# Altium project HU_SUPPORT_BOARD.PrjPcb (part 1 of 2)
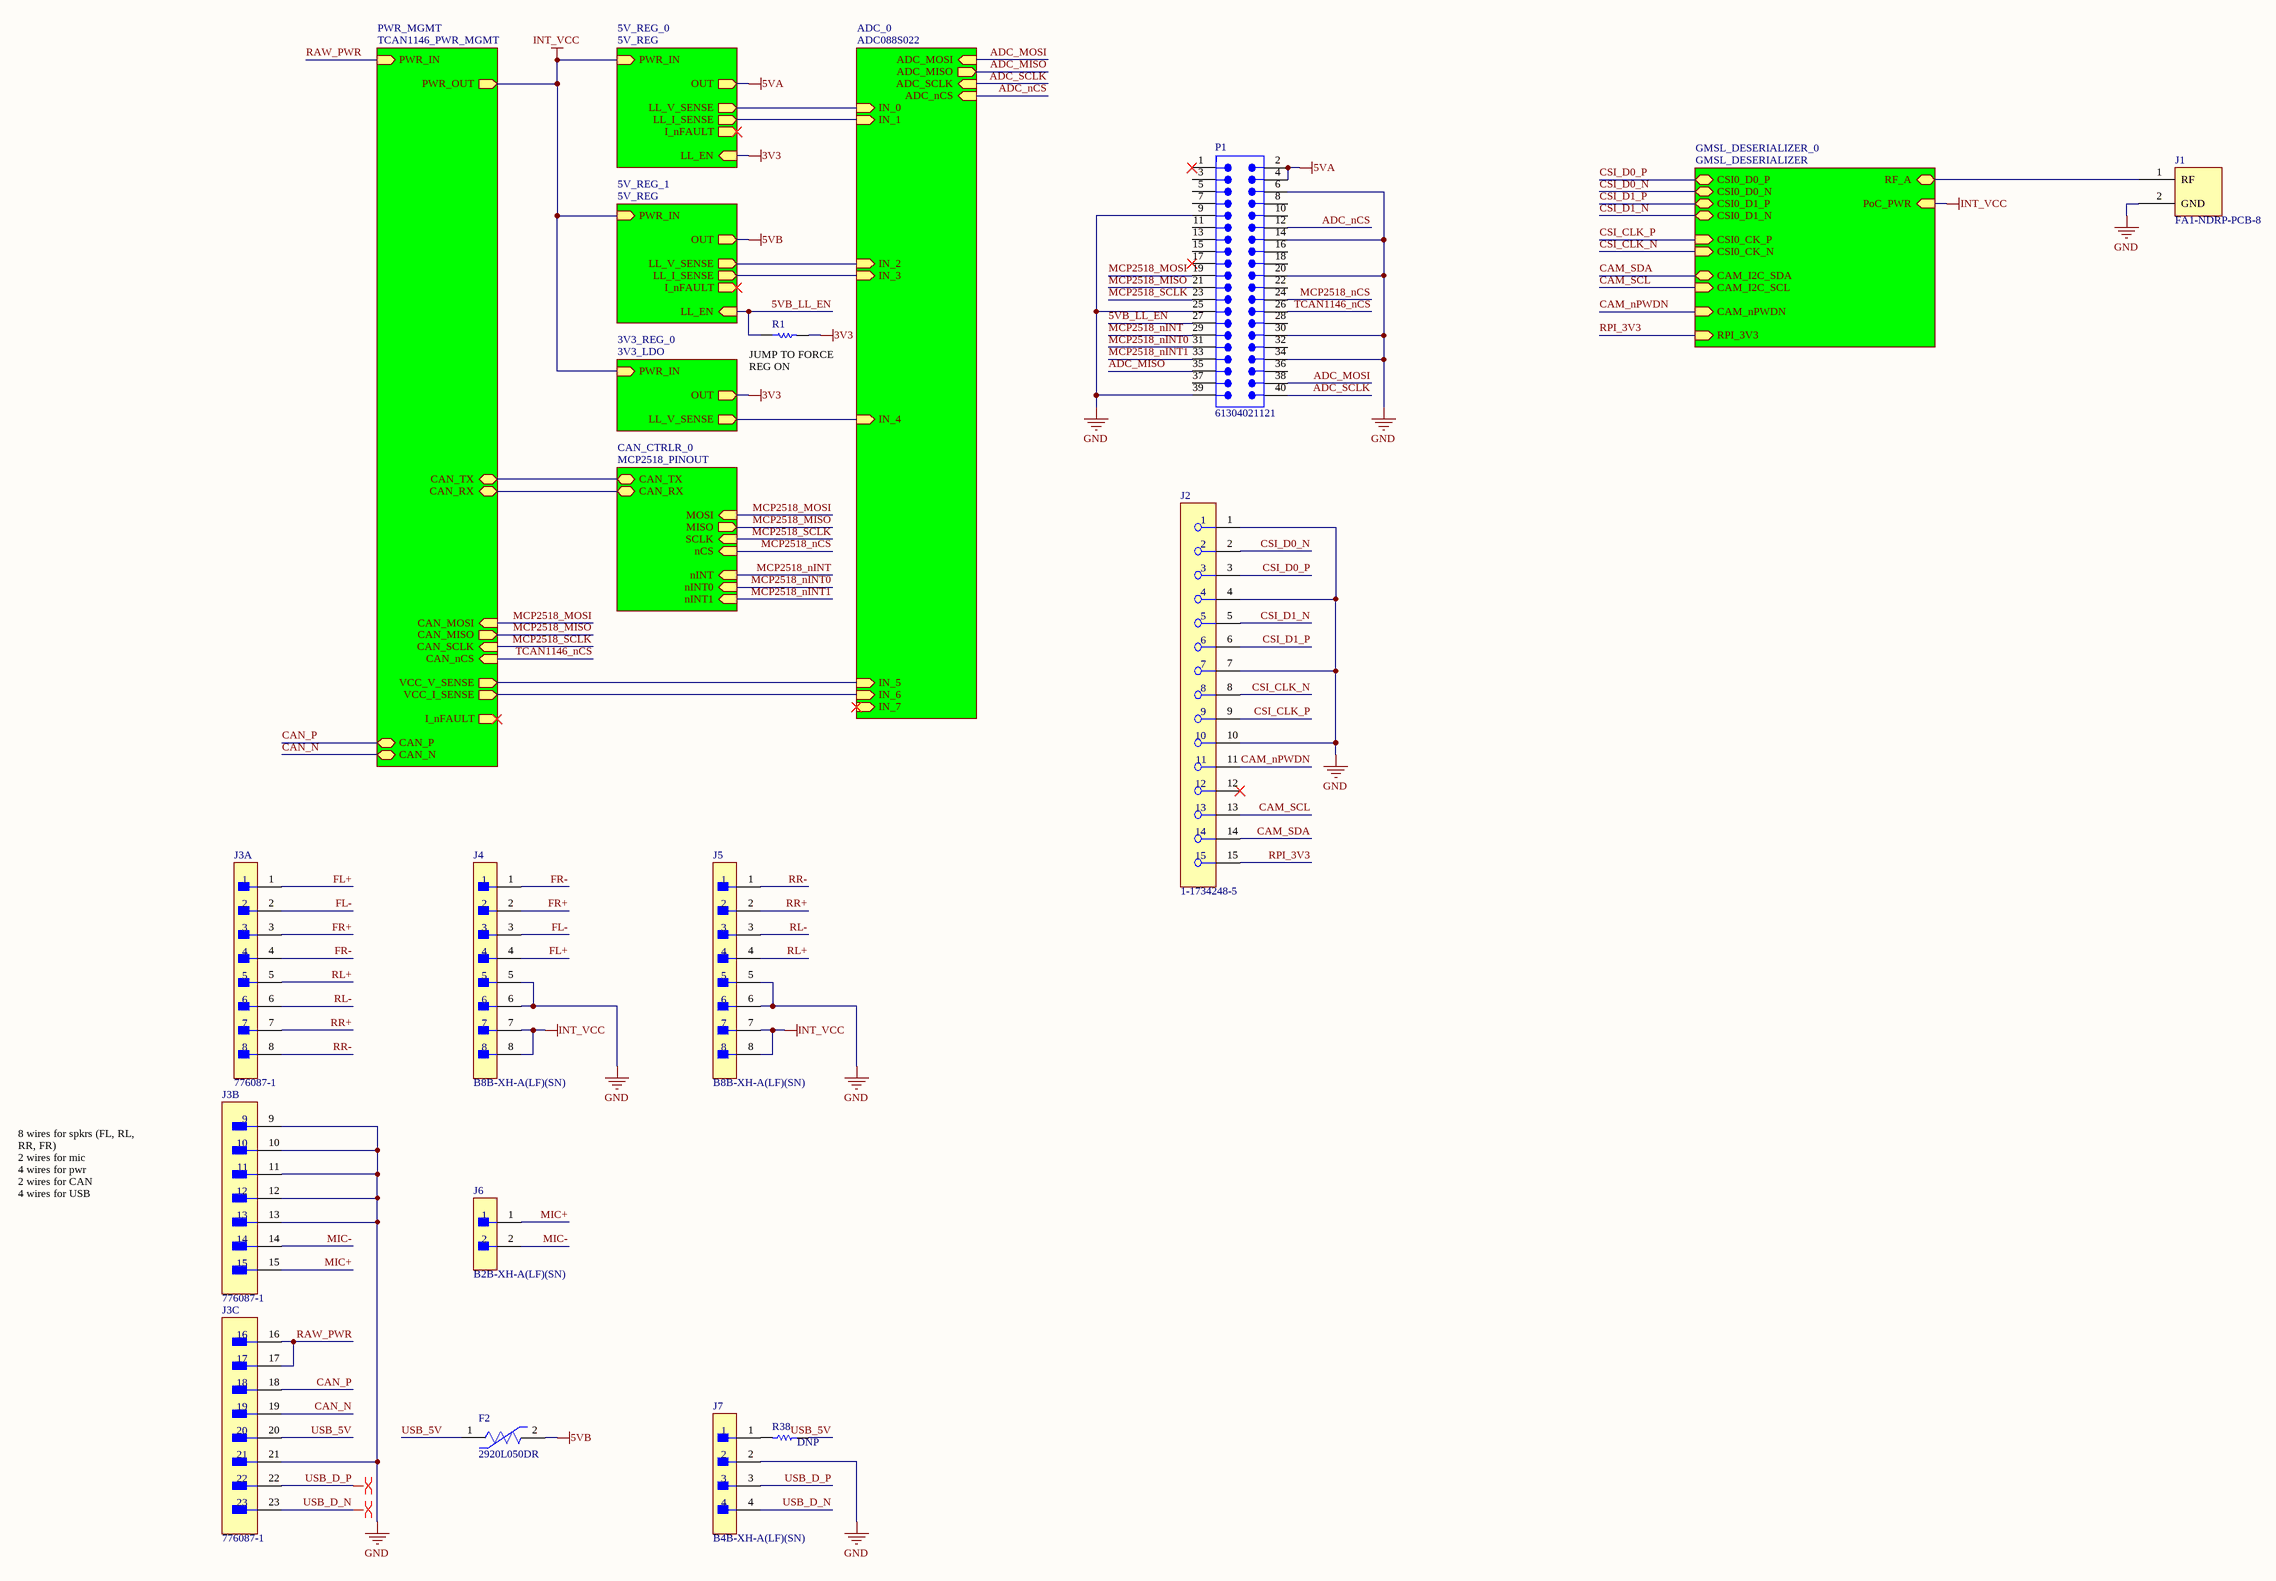
[diagram p0: HU_SUPPORT_BOARD.SchDoc]
7 sheets, 158 parts. Net scope: hierarchical (ports join the sheet entries above them; power ports are global).
Board file: HU_SUPPORT_BOARD.PcbDoc
Sheets:
  HU_SUPPORT_BOARD.SchDoc
    PWR_MGMT = TCAN1146_PWR_MGMT.SchDoc
    5V_REG_0 = 5V_REG.SchDoc
    5V_REG_1 = 5V_REG.SchDoc
    GMSL_DESERIALIZER_0 = GMSL_DESERIALIZER.SchDoc
    CAN_CTRLR_0 = MCP2518_PINOUT.SchDoc
    ADC_0 = ADC088S022.SchDoc
    3V3_REG_0 = 3V3_LDO.SchDoc

## Sheet HU_SUPPORT_BOARD.SchDoc
size C; SheetNumber: 1; SheetTotal: 7

### Parts
F2  2920L050DR  [FP-2920L050DR-MFG]
J1  FA1-NDRP-PCB-8  [FA1-NDRP-PCB-8-Footprint-1]
J2  1-1734248-5  [FP-1-1734248-5-MFG]
J3  776087-1  [FP-776087-1-MFG]  (parts A,B,C of 3)
J4  B8B-XH-A(LF)(SN)  [FP-B8B-XH-A_LF_SN-MFG]
J5  B8B-XH-A(LF)(SN)  [FP-B8B-XH-A_LF_SN-MFG]
J6  B2B-XH-A(LF)(SN)  [FP-B2B-XH-A_LF_SN-MFG]
J7  B4B-XH-A(LF)(SN)  [FP-B4B-XH-A_LF_SN-MFG]
P1  61304021121  [61304021121]
R1  DNP  [RESC1005X40X25ML05T05]  (value not drawn)
R38  DNP  [R0603B]

### Sub-sheets
3V3_REG_0 = 3V3_LDO: PWR_IN (in), OUT (out), LL_V_SENSE (out)
5V_REG_0 = 5V_REG: PWR_IN (in), LL_EN (in), OUT (out), LL_V_SENSE (out), LL_I_SENSE (out), I_nFAULT (out)
5V_REG_1 = 5V_REG: PWR_IN (in), LL_EN (in), OUT (out), LL_V_SENSE (out), LL_I_SENSE (out), I_nFAULT (out)
ADC_0 = ADC088S022: IN_0 (in), IN_1 (in), IN_2 (in), IN_3 (in), IN_4 (in), IN_5 (in), IN_6 (in), IN_7 (in), ADC_MOSI (in), ADC_MISO (out), ADC_SCLK (in), ADC_nCS (in)
CAN_CTRLR_0 = MCP2518_PINOUT: CAN_TX (bidir), CAN_RX (bidir), MOSI (in), MISO (out), SCLK (in), nCS (in), nINT (in), nINT0 (in), nINT1 (in)
GMSL_DESERIALIZER_0 = GMSL_DESERIALIZER: CSI0_D0_P (bidir), CSI0_D0_N (bidir), CSI0_D1_P (bidir), CSI0_D1_N (bidir), CSI0_CK_P (in), CSI0_CK_N (in), CAM_I2C_SDA (bidir), CAM_I2C_SCL (in), PoC_PWR (in), CAM_nPWDN (in), RF_A (bidir), RPI_3V3 (in)
PWR_MGMT = TCAN1146_PWR_MGMT: PWR_IN (in), PWR_OUT (out), CAN_TX (bidir), CAN_RX (bidir), CAN_SCLK (in), CAN_MISO (out), CAN_MOSI (in), CAN_nCS (in), VCC_V_SENSE (out), VCC_I_SENSE (out), I_nFAULT (out), CAN_P (bidir), CAN_N (bidir)

### Nets
3V3: R1.2 ; sheet 5V_REG_0/LL_EN, sheet 3V3_REG_0/OUT
5VA: P1.2 P1.4 ; sheet 5V_REG_0/OUT
5VB: F2.2 ; sheet 5V_REG_1/OUT
GND: J1.2(GND) J2.1 J2.4 J2.7 J2.10 J3.9 J3.10 J3.11 J3.12 J3.13 J3.21 J4.5 J4.6 J5.5 J5.6 J7.2 P1.6 P1.9 P1.14 P1.20 P1.25 P1.30 P1.34 P1.39
INT_VCC: J4.7 J4.8 J5.7 J5.8 ; sheet PWR_MGMT/PWR_OUT, sheet 5V_REG_0/PWR_IN, sheet 5V_REG_1/PWR_IN, sheet GMSL_DESERIALIZER_0/PoC_PWR, sheet 3V3_REG_0/PWR_IN  [project net PoC_PWR]
5VB_LL_EN: P1.27 R1.1 ; sheet 5V_REG_1/LL_EN
ADC_MISO: P1.35 ; sheet ADC_0/ADC_MISO
ADC_MOSI: P1.38 ; sheet ADC_0/ADC_MOSI
ADC_nCS: P1.12 ; sheet ADC_0/ADC_nCS
ADC_SCLK: P1.40 ; sheet ADC_0/ADC_SCLK
CAM_nPWDN: J2.11 ; sheet GMSL_DESERIALIZER_0/CAM_nPWDN
CAM_SCL: J2.13 ; sheet GMSL_DESERIALIZER_0/CAM_I2C_SCL  [project net CAM_I2C_SCL]
CAM_SDA: J2.14 ; sheet GMSL_DESERIALIZER_0/CAM_I2C_SDA  [project net CAM_I2C_SDA]
CAN_N: J3.19 ; sheet PWR_MGMT/CAN_N
CAN_P: J3.18 ; sheet PWR_MGMT/CAN_P
CAN_RX: sheet PWR_MGMT/CAN_RX, sheet CAN_CTRLR_0/CAN_RX
CAN_TX: sheet PWR_MGMT/CAN_TX, sheet CAN_CTRLR_0/CAN_TX
CSI_CLK_N: J2.8 ; sheet GMSL_DESERIALIZER_0/CSI0_CK_N
CSI_CLK_P: J2.9 ; sheet GMSL_DESERIALIZER_0/CSI0_CK_P
CSI_D0_N: J2.2 ; sheet GMSL_DESERIALIZER_0/CSI0_D0_N
CSI_D0_P: J2.3 ; sheet GMSL_DESERIALIZER_0/CSI0_D0_P
CSI_D1_N: J2.5 ; sheet GMSL_DESERIALIZER_0/CSI0_D1_N
CSI_D1_P: J2.6 ; sheet GMSL_DESERIALIZER_0/CSI0_D1_P
FL+: J3.1 J4.4
FL-: J3.2 J4.3
FR+: J3.3 J4.2
FR-: J3.4 J4.1
MCP2518_MISO: P1.21 ; sheet PWR_MGMT/CAN_MISO, sheet CAN_CTRLR_0/MISO  [project net CAN_MISO]
MCP2518_MOSI: P1.19 ; sheet PWR_MGMT/CAN_MOSI, sheet CAN_CTRLR_0/MOSI  [project net CAN_MOSI]
MCP2518_nCS: P1.24 ; sheet CAN_CTRLR_0/nCS
MCP2518_nINT: P1.29 ; sheet CAN_CTRLR_0/nINT
MCP2518_nINT0: P1.31 ; sheet CAN_CTRLR_0/nINT0
MCP2518_nINT1: P1.33 ; sheet CAN_CTRLR_0/nINT1
MCP2518_SCLK: P1.23 ; sheet PWR_MGMT/CAN_SCLK, sheet CAN_CTRLR_0/SCLK  [project net CAN_SCLK]
MIC+: J3.15 J6.1
MIC-: J3.14 J6.2
PoC_A: J1.1(RF) ; sheet GMSL_DESERIALIZER_0/RF_A
RAW_PWR: J3.16 J3.17 ; sheet PWR_MGMT/PWR_IN
RL+: J3.5 J5.4
RL-: J3.6 J5.3
RPI_3V3: J2.15 ; sheet GMSL_DESERIALIZER_0/RPI_3V3
RR+: J3.7 J5.2
RR-: J3.8 J5.1
TCAN1146_nCS: P1.26 ; sheet PWR_MGMT/CAN_nCS  [project net CAN_nCS]
USB_5V: F2.1 J3.20 R38.1
USB_D_N: J3.23 J7.4
USB_D_P: J3.22 J7.3
NetJ7_1: J7.1 R38.2
NetR4_5V_REG_0_1: sheet 5V_REG_0/LL_V_SENSE, sheet ADC_0/IN_0
NetR4_5V_REG_1_1: sheet 5V_REG_1/LL_V_SENSE, sheet ADC_0/IN_2
NetR27_1: sheet PWR_MGMT/VCC_V_SENSE, sheet ADC_0/IN_5
NetR36_1: sheet ADC_0/IN_4, sheet 3V3_REG_0/LL_V_SENSE
NetU2_5V_REG_0_7: sheet 5V_REG_0/LL_I_SENSE, sheet ADC_0/IN_1
NetU2_5V_REG_1_7: sheet 5V_REG_1/LL_I_SENSE, sheet ADC_0/IN_3
NetU7_7: sheet PWR_MGMT/VCC_I_SENSE, sheet ADC_0/IN_6

Not connected (* = marked no-connect by the designer): J2 12*; P1 1* 3 5 7 8 10 11 13 15 16 17* 18 22 28 32 36 37

### Layout directives
differential pair: USB_D_N, USB_D_P

### Notes on the sheet
- (near R1) JUMP TO FORCE REG ON
- 8 wires for spkrs (FL, RL, RR, FR)
  2 wires for mic
  4 wires for pwr
  2 wires for CAN
  4 wires for USB

### Library data of the parts
F2 = CMP-08606-000071-1: PTC RESET FUSE 60V 500MA 2920; Resistance: 1.4R; Trip Current: 1A; Power Dissipation: 1.5W; Time to Trip: 4s; Approvals: cULus; Current Rating: 10A; Operating Supply Voltage: 60V; Termination: SMD/SMT; Width: 5.44mm; Case/Package: 2920; Series: 2920L; Case Code (Imperial): 2920; Height: 1.25mm; Hold Current: 500mA; Terminal Material: Copper; Min Operating Temperature: -40°C; Package Quantity: 1500; Max Voltage Rating (DC): 60V; RoHS Compliant: Yes; Case Code (Metric): 7351; Lead Free: Lead Free; Max Operating Temperature: 85°C; Voltage Rating (DC): 60V; Working Voltage: 60V; Length: 7.98mm; REACH SVHC: No SVHC; Max Current Rating: 10A; Voltage Rating: 60V; Packaging: Tape and Reel
J1 = CMP-002-00054-1: RF F Connector, Male, Board Mount, Solder Terminal, Plug; Connector Type: RF F CONNECTOR; RoHS Compliant: Yes; Mounting Technology: Board
J2 = CMP-03368-000001-1: CONN FPC VERT 15POS 1.00MM SMD; Manufacturer: TE; Conn Orientation: Vertical; Conn Gender: Female; Current Rating: 1A; Is Female: yes; Number Of Contacts: 15; Pitch: 1mm; Voltage Rating: 125V; ComponentLink2URL: https://www.te.com/commerce/DocumentDelivery/DDEController?Action=showdoc&DocId=Customer+Drawing%7F1734248%7FE1%7Fpdf%7FEnglish%7FENG_CD_1734248_E1__.pdf%7F1-1734248-5; Device Class L1: Connectors; Category: Conn; Package: 0; Lead Free: Yes; Digikey Description: CONN FPC VERT 15POS 1.00MM SMD; Height: 8mm; Manufacturer Part Number: 1-1734248-5; Temperature: -20°C to +85°C; Contact Material: Gold,Nickel; Device Class L3: unset; ComponentLink2Description: Datasheet; RoHS: TRUE; Temperature Range Low: -20°C; Octopart: https://octopart.com/1-1734248-5-te+connectivity-40620898; Device Class L2: FFC / FPC; Mouser Description: FFC & FPC Connectors 15P 1.0 FPC, Zip V/T SMT; Automotive: No; Temperature Range High: +85°C; Mounting Type: Surface Mount
J3 = CMP-03369-000157-2: CONN HEADER R/A 23POS 4MM; Max Voltage Rating (AC): 250V; PCB Thickness: 0.062inch; PCB Mount Alignment: Yes (With); Primary Type: Rectangular; Number of Signal Positions: 23; Row Spacing: 0.157inch; Current Rating: 17A; Connector System: Wire-to-Device; Number of Ports: 1; Shielding: Unshielded; PCB Mount Retention: With; Circuit Application: Power; Tab Thickness: 1.3mm; Gender: Male; Contact Shape: Circular; Mount: Through Hole; ELV: Compliant; Orientation: Right Angle; Lead Free: Lead Free; Contact Plating: Tin; Package Quantity: 1; RoHS Compliant: Yes; Connector Type: Header; Series: Ampseal; Termination: Solder; Voltage Rating (AC): 250V; Contact Material: Brass; Number of Rows: 3; Depth: 37.9mm; Housing Material: Polybutylene; Fastening Type: Ramp; Width: 37.9mm; Flammability Rating: UL94 V-0; Housing Color: Black; Radiation Hardening: No; Contact Type: Male Pin; Sealable: Yes (With); Length: 60.8mm; Max Operating Temperature: 221°C; Packaging: Bulk; Number of Positions: 23; Insulation Material: PBT; Pitch: 0.157inch; Contact Finish - Mating: TIN; Color: Black; Number of Terminals/Pins: 23; Insulation Color: Black; Number of Contacts: 23; Min Operating Temperature: -40°C
J4 J5 = CMP-17438-000015-1: CONN HEADER VERT 8POS 2.5MM; Voltage Rating (AC): 250V; Insulation Resistance: 1GR; Connector Type: Male Pin; Max Current Rating: 3A; Wire/Cable Gauge: 22AWG; Number of Contacts: 8; Contact Resistance: 20mR; Orientation: Straight; Pitch: 2.5mm; Min Operating Temperature: -25°C; Number of Rows: 1; Contact Type: Male Pin; Packaging: Bulk; Lead Free: Lead Free; Max Operating Temperature: 85°C; Housing Material: Polyamide; Voltage Rating: 250V; Series: XH; Mount: Through Hole; Depth: 5.75mm; Contact Material: Brass; Fastening Type: Detent; Color: Natural; Max Voltage Rating (AC): 250V; Number of Positions: 8; Housing Color: White; Contact Plating: Tin; Lead Pitch: 2.5mm; Length: 22.4mm; REACH SVHC: No SVHC; Termination: Press-Fit; Current Rating: 3A
J6 = CMP-2000-05888-3: CONN HEADER VERT 2POS 2.5MM; Current Rating: 3A; Voltage Rating: 250V; Number of Contacts: 2; Contact Resistance: 20mR; Wire/Cable Gauge: 22AWG; Insulation Resistance: 1GR; Connector Type: Male Pin; Packaging: Bulk; Contact Material: Brass; Lead Free: Lead Free; Orientation: Straight; Contact Plating: Tin; Max Current Rating: 3A; Termination: Solder; Fastening Type: Detent; Depth: 5.75mm; Housing Material: Polyamide; REACH SVHC: No SVHC; Series: XH; Voltage Rating (AC): 250V; Number of Positions: 2; Color: Natural; Contact Type: Male Pin; Max Voltage Rating (DC): 250V; Pitch: 2.5mm; Lead Pitch: 2.5mm; Mount: Through Hole; Max Operating Temperature: 85°C; Length: 7.4mm; Max Voltage Rating (AC): 250V; Min Operating Temperature: -25°C; Number of Rows: 1; Housing Color: White
J7 = CMP-17439-000250-1: CONN HEADER VERT 4POS 2.5MM; Number of Contacts: 4; Contact Resistance: 20mR; Voltage Rating: 250V; Max Current Rating: 3A; Gender: Male; Wire/Cable Gauge: 22AWG; Mated Stacking Heights: 9.8mm; Insulation Resistance: 1GR; Orientation: Straight; Contact Type: Male Pin; Contact Finish - Mating: TIN; Series: XH; Max Voltage Rating (AC): 250V; Lead Pitch: 2.5mm; Contact Shape: Square; Insulation Color: Natural; Termination: Solder; Lead Free: Lead Free; Voltage Rating (AC): 250V; Number of Rows: 1; Flammability Rating: UL94 V-0; Number of Positions: 4; Max Operating Temperature: 85°C; Package Quantity: 500; Mount: Through Hole; REACH SVHC: No SVHC; Connector Type: Header; Insulation Material: Nylon; Fastening Type: Detent; Min Operating Temperature: -25°C; Housing Color: White; Packaging: Bulk; Contact Plating: Tin; Contact Material: Brass; Max Voltage Rating (DC): 250V; Housing Material: Polyamide; Color: Natural; Material: Polyamide; Pitch: 2.5mm; Depth: 5.75mm; Current Rating: 3A; Length: 12.4mm
P1 = CMP-1502-01135-3: NexarPartId: 32855579; Pitch: 2.54mm; Operating Supply Voltage: 250V; Gender: Male; Number of Positions: 40; Current Rating: 3A; Contact Resistance: 20mΩ; Connector Type: Male Pin; Color: Black; Contact Plating: Gold; Contact Material: Copper; Number of Rows: 2; Row Spacing: 2.54mm; Mount: Through Hole; RoHS: Compliant; Contact Mating Length: 5.9944mm; Voltage Rating: 250V; Orientation: Vertical; Max Operating Temperature: 105°C; REACH SVHC: Unknown; Min Operating Temperature: -40°C; Lead Pitch: 2.54mm; Height: 8.89mm; Termination: Solder; Number of Pins: 40; Number of Contacts: 40; Packaging: Bulk
R1 = CMP-009-00118-2: READ THE NAME; Pins: 2; Component Type: Standard; Design Item ID: CMP-009-00206-2; Source: 0402jump.SchLib
R38 = CMP-009-00002-14: Resistor; Value: DNP

## Sheet TCAN1146_PWR_MGMT.SchDoc
size C; SheetNumber: 5; SheetTotal: 7
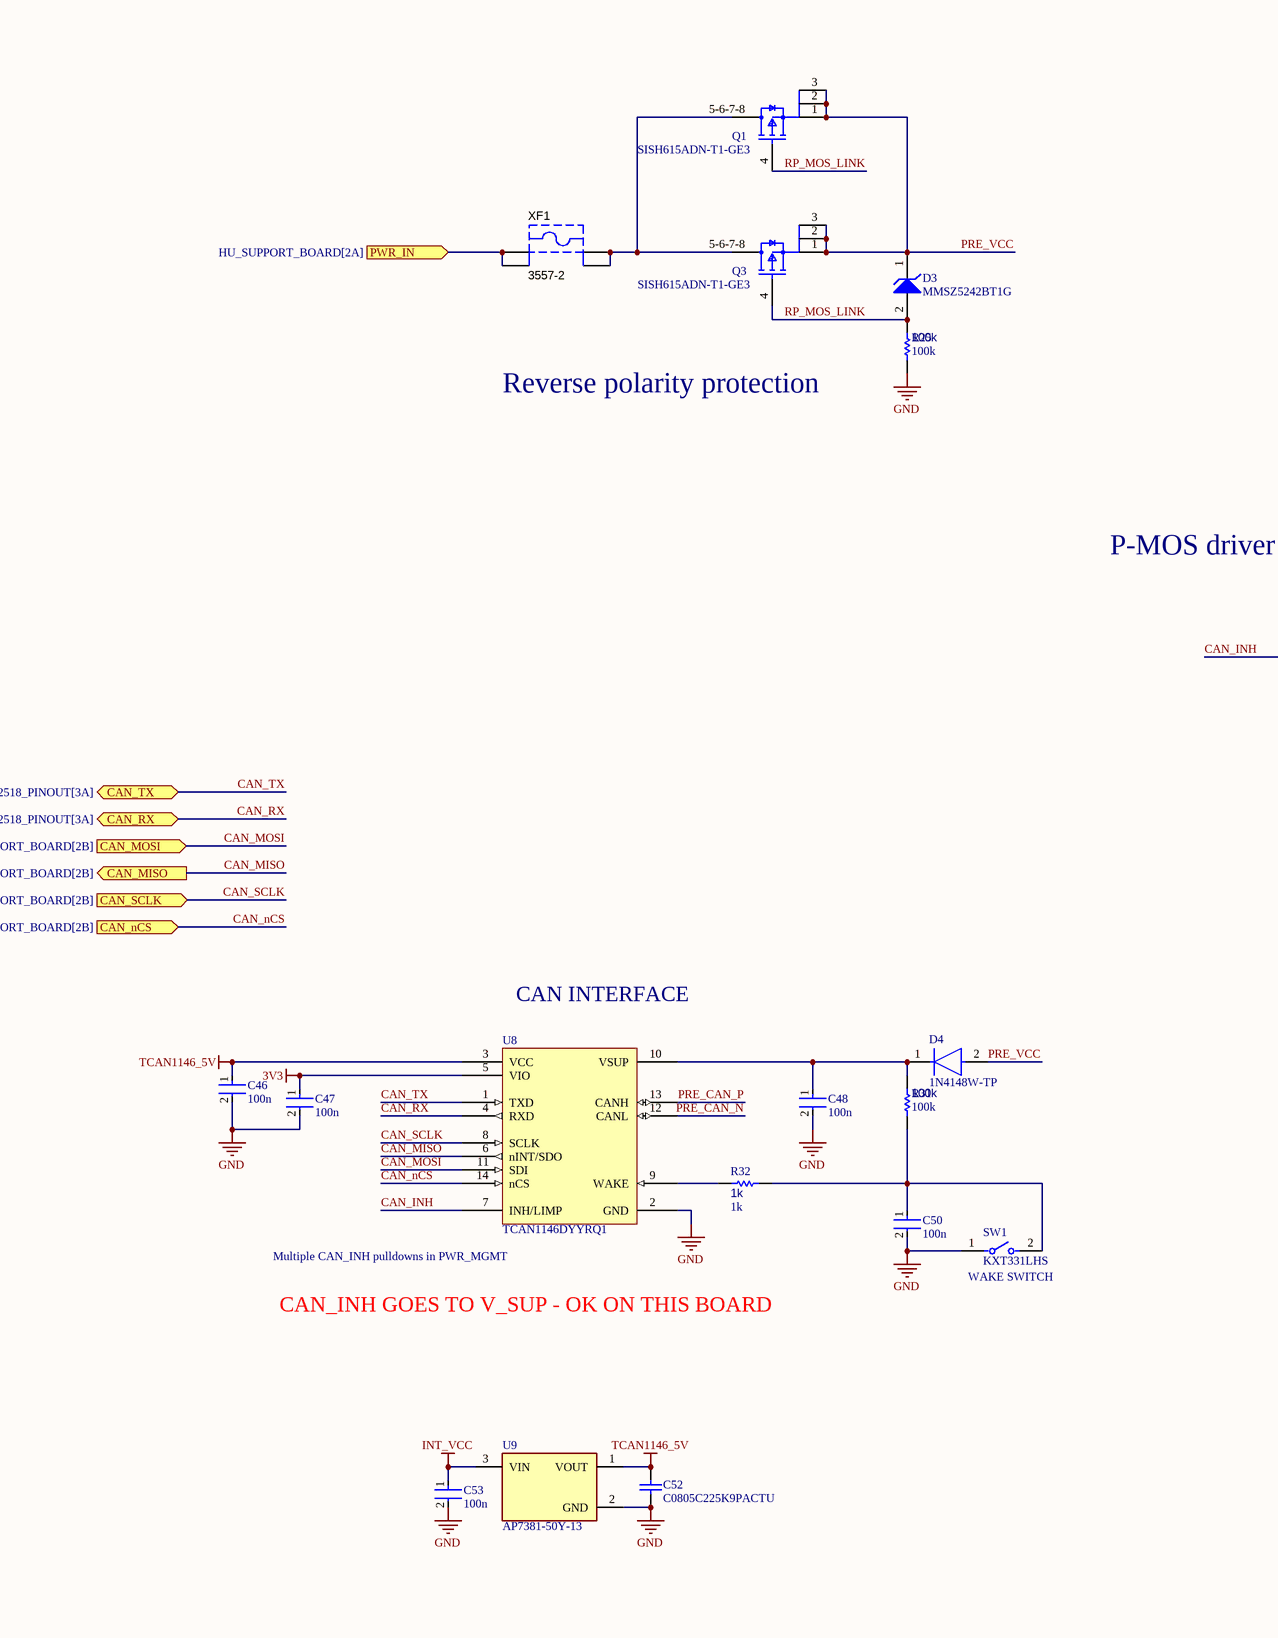
[diagram p1: TCAN1146_PWR_MGMT.SchDoc, left]
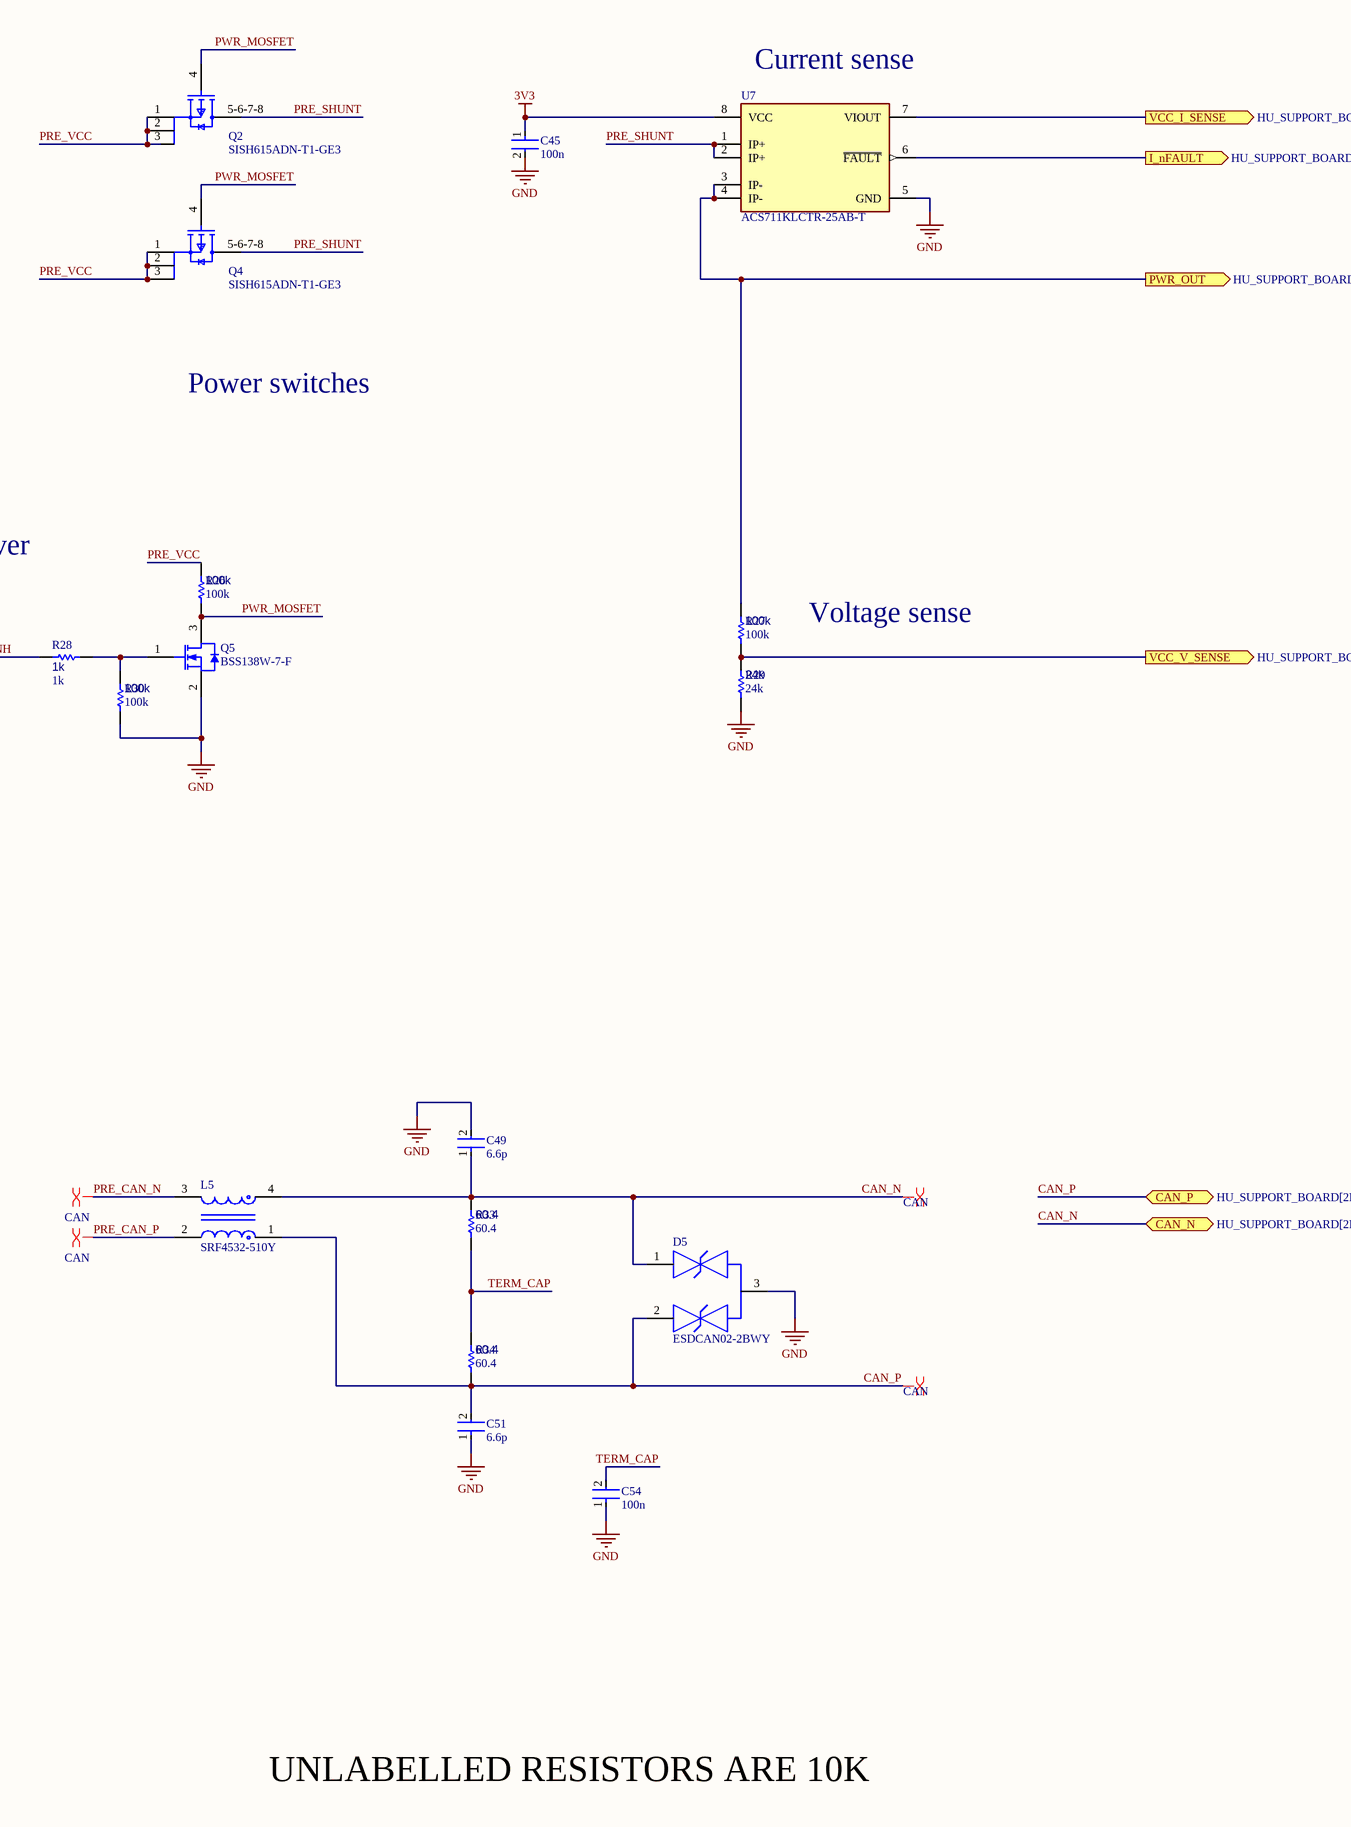
[diagram p2: TCAN1146_PWR_MGMT.SchDoc, right]

### Parts
C45  100n  [FP-0402-L_1_0_0_05-W_0_5-IPC_A]
C46  100n  [FP-0402-L_1_0_0_05-W_0_5-IPC_A]
C47  100n  [FP-0402-L_1_0_0_05-W_0_5-IPC_A]
C48  100n  [FP-0402-L_1_0_0_05-W_0_5-IPC_A]
C49  6.6p  [FP-0402-L_1_0_0_05-W_0_5-IPC_A]
C50  100n  [FP-0402-L_1_0_0_05-W_0_5-IPC_A]
C51  6.6p  [FP-0402-L_1_0_0_05-W_0_5-IPC_A]
C52  C0805C225K9PACTU  [CAPC2013X145X50ML20T25]
C53  100n  [FP-0402-L_1_0_0_05-W_0_5-IPC_A]
C54  100n  [FP-0402-L_1_0_0_05-W_0_5-IPC_A]
D3  MMSZ5242BT1G  [ONSC-SOD-123-2-425-04_V]
D4  1N4148W-TP  [FP-SOD-123-IPC_A]
D5  ESDCAN02-2BWY  [FP-SOT323-3L-MFG]
L5  SRF4532-510Y  [FP-SRF4532-MFG]
Q1  SISH615ADN-T1-GE3  [SISH615ADN-T1-GE3-Footprint-1]
Q2  SISH615ADN-T1-GE3  [SISH615ADN-T1-GE3-Footprint-1]
Q3  SISH615ADN-T1-GE3  [SISH615ADN-T1-GE3-Footprint-1]
Q4  SISH615ADN-T1-GE3  [SISH615ADN-T1-GE3-Footprint-1]
Q5  BSS138W-7-F  [DIOD-SOT323-3_V]
R25  100k  [R0603B]
R26  100k  [R0603B]
R27  100k  [R0603B]
R28  1k  [R0603B]
R29  24k  [R0603B]
R30  100k  [R0603B]
R31  100k  [R0603B]
R32  1k  [R0603B]
R33  60.4  [R0603B]
R34  60.4  [R0603B]
SW1  KXT331LHS  [FP-KXT331LHS-MFG]
U7  ACS711KLCTR-25AB-T  [FP-LC-8-IPC_A]
U8  TCAN1146DYYRQ1  [TCAN1146DYYRQ1-Footprint-1]
U9  AP7381-50Y-13  [FP-SOT89-MFG]
XF1  3557-2  [KSTN-3557-2]

### Ports
CAN_MISO (out, see HU_SUPPORT_BOARD[2B]), CAN_MOSI (in, see HU_SUPPORT_BOARD[2B]), CAN_N (bidir, see HU_SUPPORT_BOARD[2B]), CAN_nCS (in, see HU_SUPPORT_BOARD[2B]), CAN_P (bidir, see HU_SUPPORT_BOARD[2B]), CAN_RX (bidir, see HU_SUPPORT_BOARD[2B], MCP2518_PINOUT[3A]), CAN_SCLK (in, see HU_SUPPORT_BOARD[2B]), CAN_TX (bidir, see HU_SUPPORT_BOARD[2B], MCP2518_PINOUT[3A]), I_nFAULT (out, see HU_SUPPORT_BOARD[2B]), PWR_IN (in, see HU_SUPPORT_BOARD[2A]), PWR_OUT (out, see HU_SUPPORT_BOARD[2A]), VCC_I_SENSE (out, see HU_SUPPORT_BOARD[2B]), VCC_V_SENSE (out, see HU_SUPPORT_BOARD[2B])

### Nets
3V3: C45.1 C47.1 U7.8(VCC) U8.5(VIO)
GND: C45.2 C46.2 C47.2 C48.2 C49.2 C50.2 C51.1 C52.1 C53.2 C54.1 D5.3 Q5.2(S) R25.1 R29.1 R30.1 SW1.1 U7.5(GND) U8.2(GND) U9.2(GND)
INT_VCC: C53.1 R27.2 U7.3(IP-) U7.4(IP-) U9.3(VIN) ; port PWR_OUT  [project net PoC_PWR]
TCAN1146_5V: C46.1 C52.2 U8.3(VCC) U9.1(VOUT)
CAN_INH: R28.1 U8.7(INH/LIMP)
CAN_MISO: U8.6(nINT/SDO) ; port CAN_MISO
CAN_MOSI: U8.11(SDI) ; port CAN_MOSI
CAN_N: C49.1 D5.1 L5.4 R33.2 ; port CAN_N
CAN_nCS: U8.14(nCS) ; port CAN_nCS
CAN_P: C51.2 D5.2 L5.1 R34.1 ; port CAN_P
CAN_RX: U8.4(RXD) ; port CAN_RX
CAN_SCLK: U8.8(SCLK) ; port CAN_SCLK
CAN_TX: U8.1(TXD) ; port CAN_TX
PRE_CAN_N: L5.3 U8.12(CANL)
PRE_CAN_P: L5.2 U8.13(CANH)
PRE_SHUNT: Q2.5-6-7-8(D) Q4.5-6-7-8(D) U7.1(IP+) U7.2(IP+)
PRE_VCC: D3.1(K) D4.2(A) Q1.1(S) Q1.2(S) Q1.3(S) Q2.1(S) Q2.2(S) Q2.3(S) Q3.1(S) Q3.2(S) Q3.3(S) Q4.1(S) Q4.2(S) Q4.3(S) R26.2
PWR_MOSFET: Q2.4(G) Q4.4(G) Q5.3(D) R26.1
RAW_PWR: XF1.1 XF1.2 ; port PWR_IN
RP_MOS_LINK: D3.2(A) Q1.4(G) Q3.4(G) R25.2
TERM_CAP: C54.2 R33.1 R34.2
NetC48_1: C48.1 D4.1(C) R31.2 U8.10(VSUP)
NetC50_1: C50.1 R31.1 R32.2 SW1.2
NetQ1_5-6-7-8: Q1.5-6-7-8(D) Q3.5-6-7-8(D) XF1.3 XF1.4
NetQ5_1: Q5.1(G) R28.2 R30.2
NetR27_1: R27.1 R29.2 ; port VCC_V_SENSE
NetR32_1: R32.1 U8.9(WAKE)
NetU7_6: U7.6(~{FAULT}) ; port I_nFAULT
NetU7_7: U7.7(VIOUT) ; port VCC_I_SENSE

### Layout directives
differential pair; differential pair class CAN: CAN_N, CAN_P, PRE_CAN_N, PRE_CAN_P

### Notes on the sheet
- (near U7) Current sense
- (near R25) Reverse polarity protection
- Power switches
- P-MOS driver
- Voltage sense
- CAN INTERFACE
- (near U8) Multiple CAN_INH pulldowns in PWR_MGMT
- (near SW1) WAKE SWITCH
- CAN_INH GOES TO V_SUP - OK ON THIS BOARD
- UNLABELLED RESISTORS ARE 10K

### Library data of the parts
C45-C51 C53 C54 = CMP-001-00058-1: LARGE PADS, 0402 CAP, CHANGE COMMENT TO MATCH REAL P/N; Capacitor Type: Ceramic; Min Operating Temperature: -55°C; Mounting Technology: Surface Mount; Pins: 2; Case/Package: 0402; RoHS Compliant: Yes; Max Operating Temperature: 85°C
C52 = CMP-1036-04819-2: Manufacturer: Kemet; Part Number: C0805C225K9PACTU
D3 = CMP-1060-00565-1: Zener Voltage Regulator, 500 mW, 2-Pin SOD-123, Pb-Free, Tape and Reel; Manufacturer: On Semiconductor; P Max (W): 0.5; VZ Typ (V): 12; PartNumber: MMSZ5242BT1G; PackageReference: SOD-123-2-425-04; ComponentLink3URL: http://www.onsemi.com/pub_link/Collateral/425-04.PDF; Mounting Technology: Surface Mount; ComponentLink2Description: Datasheet; ComponentLink1URL: http://www.onsemi.com/; ComponentLink3Description: Package Specification; PackageDescription: 2-Pin SOD, Body 1.6 x 2.69 mm; PackageVersion: Rev. G, 10/2009; ComponentLink1Description: Manufacturer URL; RoHS: Pb-Free; ComponentLink2URL: http://www.onsemi.com/pub_link/Collateral/MMSZ5221BT1-D.PDF; Packing: Tape and Reel; DatasheetVersion: Rev. 12
D4 = CMP-2000-04993-2: DIODE GEN PURP 100V 150MA SOD123; Max Reverse Leakage Current: 5uA; Max Surge Current: 2A; Reverse Recovery Time: 4ns; Polarity: Standard; Capacitance: 4pF; Max Forward Surge Current (Ifsm): 1A; Element Configuration: Single; Power Dissipation: 400mW; Forward Voltage: 1V; Radiation Hardening: No; Lead Free: Lead Free; Max Reverse Voltage (DC): 100V; Current Rating: 150mA; Forward Current: 150mA; Packaging: Tape and Reel; Number of Pins: 2; Package Quantity: 3000; Max Operating Temperature: 150°C; Min Operating Temperature: -65°C; Average Rectified Current: 150mA; Recovery Time: 4ns; Output Current: 150mA; Peak Non-Repetitive Surge Current: 2A; Width: 1.8mm; Voltage Rating (DC): 100V; Height: 1.2mm; Max Repetitive Reverse Voltage (Vrrm): 100V; Mount: Surface Mount; Length: 2.85mm
D5 = CMP-12225-000055-1: TVS DIODE 26.5V 44V SOT323-3; Manufacturer: STMicroelectronics; Value: 3pF; Direction: Bidirectional; Breakdown Voltage: 28.5V; Automotive Grade: Grade 0; Standoff Height: 0mm; Peak Pulse Power: 170W; Peak Pulse Current: 3A; Number Of Channels: 2; Max Junction Temp: +175°C; Mouser Description: TVS Diodes / ESD Suppressors Automotive dual-line Transil, Transient voltage suppressor (TVS) for CAN bus; Height: 1.1mm; Category: Diode; Reverse Standoff Voltage: 26.5V; Device Class L1: Circuit Protection; Temperature: -55°C to +175°C; RoHS: TRUE; ComponentLink2URL: https://www.st.com/resource/en/datasheet/esdcan02-2bwy.pdf; Device Class L3: unset; Device Class L2: TVS Diodes; Temperature Range High: +175°C; Octopart: https://octopart.com/esdcan02-2bwy-stmicroelectronics-58631133; Ipc Land Pattern Name: SOT65P210X95-3; Temperature Range Low: -55°C; Capacitance: 3pF; Digikey Description: TVS DIODE 26.5V 44V SOT323-3; Automotive: Yes; ComponentLink2Description: Datasheet; Clamping Voltage: 44V; Manufacturer Part Number: ESDCAN02-2BWY; Lead Free: Yes; Package: SOT323-3L
L5 = CMP-07251-000006-1: CMC 51UH 200MA 2LN 2KOHM SMD; Element Configuration: Dual; Number of Lines: 2; Core Material: Ferrite; Impedance: 2kR; Test Frequency: 100kHz; Voltage Rating (DC): 50V; Insulation Resistance: 10MR; Material: Steel; Tolerance: 50%; DC Resistance (DCR): 3.5R; RoHS Compliant: Yes; Mount: Surface Mount; REACH SVHC: No SVHC; Termination: SMD/SMT; DC Current: 200mA; Current: 200mA; Lead Free: Lead Free; Contact Plating: Tin; Length: 4.5mm; Max DC Current: 200mA; Width: 0.126inch; Case/Package: 4532; Packaging: Tape and Reel; Package Quantity: 1; Min Operating Temperature: -40°C; Depth: 3.4mm; Series: SRF4532; Max Operating Temperature: 125°C; Current Rating: 200mA; Self Resonant Frequency: 100kHz; Height: 0.118inch; Inductance: 51uH; Resistance: 2kR
Q1-Q4 = CMP-013-00018-2: Trans MOSFET P-CH 20V 22.1A 8-Pin PowerPAK 1212 EP T/R; Source: SISH615ADN-T1-GE3.SchLib; Design Item ID: CMP-013-00036-4; Component Type: Standard; Pins: 5
Q5 = CMP-2000-05968-1: N-Channel Enhancement Mode Mosfet, 50 V, 200 mA, -55 to 150 degC, 6-Pin SOT-323, RoHS, Tape and Reel; Typical Turn-Off Delay Time: 20ns; Number of Channels: 1Channel; Type: EnhancementModeFieldEffectTransistor; Brand: DiodesIncorporated; Vds - Drain-Source Breakdown Voltage: 75V; Vgs - Gate-Source Voltage: 20V; Rds On - Drain-Source Resistance: 1.4Ohms; Transistor Type: 1N-Channel; Configuration: Single; Unit Weight: 0.000212oz; Pd - Power Dissipation: 200mW; Id - Continuous Drain Current: 200mA; Forward Transconductance - Min: 0.1S; Manufacturer URL: http://www.diodes.com/; Series: BSS138; Package Description: 3-Pin Small Outline Transistor, Body 2 x 1.25 mm, Pitch 0.65 mm; Mounting Technology: SurfaceMount; Product Category: MOSFET; RoHS: True; Maximum Operating Temperature: +150C; Height: 1mm; Length: 2.2mm; Technology: Si; Width: 1.35mm; Datasheet URL: http://www.diodes.com/_files/datasheets/ds30206.pdf; Manufacturer: DiodesIncorporated; Package / Case: SOT-323-3; Typical Turn-On Delay Time: 20ns; Transistor Polarity: N-Channel; Factory Pack Quantity: 3000; Packaging: Reel; Product: MOSFETSmallSignal; Datasheet Version: Rev. 11-2, 09/2013; Package Reference: SOT323; Minimum Operating Temperature: -55C; Mounting Style: SMD/SMT; Channel Mode: Enhancement
R25-R34 = CMP-009-00002-14: Resistor
  R25-R27 R30 R31: Value: 100k
  R28 R32: Value: 1k
  R29: Value: 24k
  R33 R34: Value: 60.4
SW1 = CMP-10040-000029-1: SWITCH TACTILE SPST-NO 0.02A 15V; Operating Force: 240gf; Switch Travel: 0.13mm; Illumination Type: Non-Illuminated; Throw Configuration: SPST; Number of Ports: 1; Current Rating: 5A; Mechanical Life: 500000Cycles; Switch Function: Off-Mom; Connector Type: USB; Actuator Type: Standard; Gender: Receptacle; Number of Contacts: 24; Contact Plating: Gold; Insulation Color: Black; Min Operating Temperature: -40°C; Packaging: Tape and Reel; Flammability Rating: UL94 V-0; Max Operating Temperature: 85°C; Termination: Solder; Mount: Surface Mount
U7 = CMP-1557-00015-2: SENSOR CURRENT HALL 25A AC/DC; Bandwidth: 100kHz; Min Supply Voltage: 3V; Polarity: Bidirectional; Max Supply Voltage: 5.5V; Max Supply Current: 5.5mA; Number of Channels: 1; Quiescent Current: 4mA; Sensitivity: 55mV/A; Accuracy: 4%; Linearity: 1%; Operating Supply Voltage: 3.3V; Response Time: 4.6us; Case/Package: SOIC; Min Operating Temperature: -40°C; RoHS Compliant: Yes; Length: 4.9mm; Package Quantity: 1; Number of Pins: 8; Width: 3.9mm; REACH SVHC: No SVHC; -3db Bandwidth: 100kHz; Series: -; Packaging: Tape and Reel; Max Operating Temperature: 125°C; Current Sensing: 25A; Height: 1.5mm; Frequency: 100kHz
U8 = CMP-318-000000-2: Automotive CAN FD transceiver with watchdog, bus diagnostics and partial networking via sele 14-SOT-23-THIN -40 to 150; Component Type: Standard; Design Item ID: CMP-015-00012-2; Pin Count: 14; Source: TCAN1146DYYRQ1.SchLib
U9 = CMP-12756-000009-1: IC REG LINEAR 5V 150MA SOT89; Manufacturer: Diodes Inc.; Output Type: Fixed; Min Supply Voltage: 3.3V; Max Junction Temp: +125°C; Max Supply Voltage: 40V; Nominal Supply Current: 2.5-25uA; Number Of Outputs: 1; Dropout Voltage: 1000mV; Manufacturer Part Number: AP7381-50Y-13; RoHS: TRUE; Digikey Description: IC REG LINEAR 5V 150MA SOT89; Output Voltage: 5V; Footprint Url: https://www.diodes.com/assets/Package-Files/SOT89.pdf; Category: IC; Temperature: -40°C to +125°C; ComponentLink2Description: Datasheet; Package: SOT89; Temperature Range Low: -40°C; Temperature Range High: +125°C; ComponentLink2URL: https://www.diodes.com/assets/Datasheets/AP7381.pdf; Device Class L1: Integrated Circuits (ICs); Automotive: No; Output Current: 150mA; Ambient Temperature Range High: +85°C; Octopart: https://octopart.com/ap7381-50y-13-diodes+inc.-87775116; Lead Free: Yes; Device Class L2: Power Management ICs; Height: 1.6mm; Device Class L3: Voltage Regulators - Linear; Ambient Temperature Range Low: -40°C
XF1 = CMP-2000-05461-1: FUSE HOLDER, PCB MOUNT, 500VAC, 20A, ROHS; Manufacturer: Keystone-Electronics; Number of Circuits: 1; Voltage: 500V; Fuseholder Type: Block; Fuse Type: Blade; Fuse Size: 0.43"Lx0.15"Wx0.64"H(10.92mmx3.81mmx16.25mm); For Use With/Related Products: ATC,ATO257,MINI897; Current Rating: 30A; Datasheet URL: http://datasheet.octopart.com/3557-2-Keystone-datasheet-15715937.pdf; Orientation: Vertical; Family: Fuseholders; Datasheet Version: Apr-13; Contact Finish: TinNickel; Mounting Type: PCB; Series: -; Category: CircuitProtection; Termination Style: PCPin; Contact Material: Brass; Manufacturer URL: http://www.keyelco.com/

## Sheet 5V_REG.SchDoc
size A4; SheetNumber: 2; SheetTotal: 7
Used 2 times, as channels 5V_REG_0, 5V_REG_1. Parts and nets are listed once, with the designators drawn on the sheet.
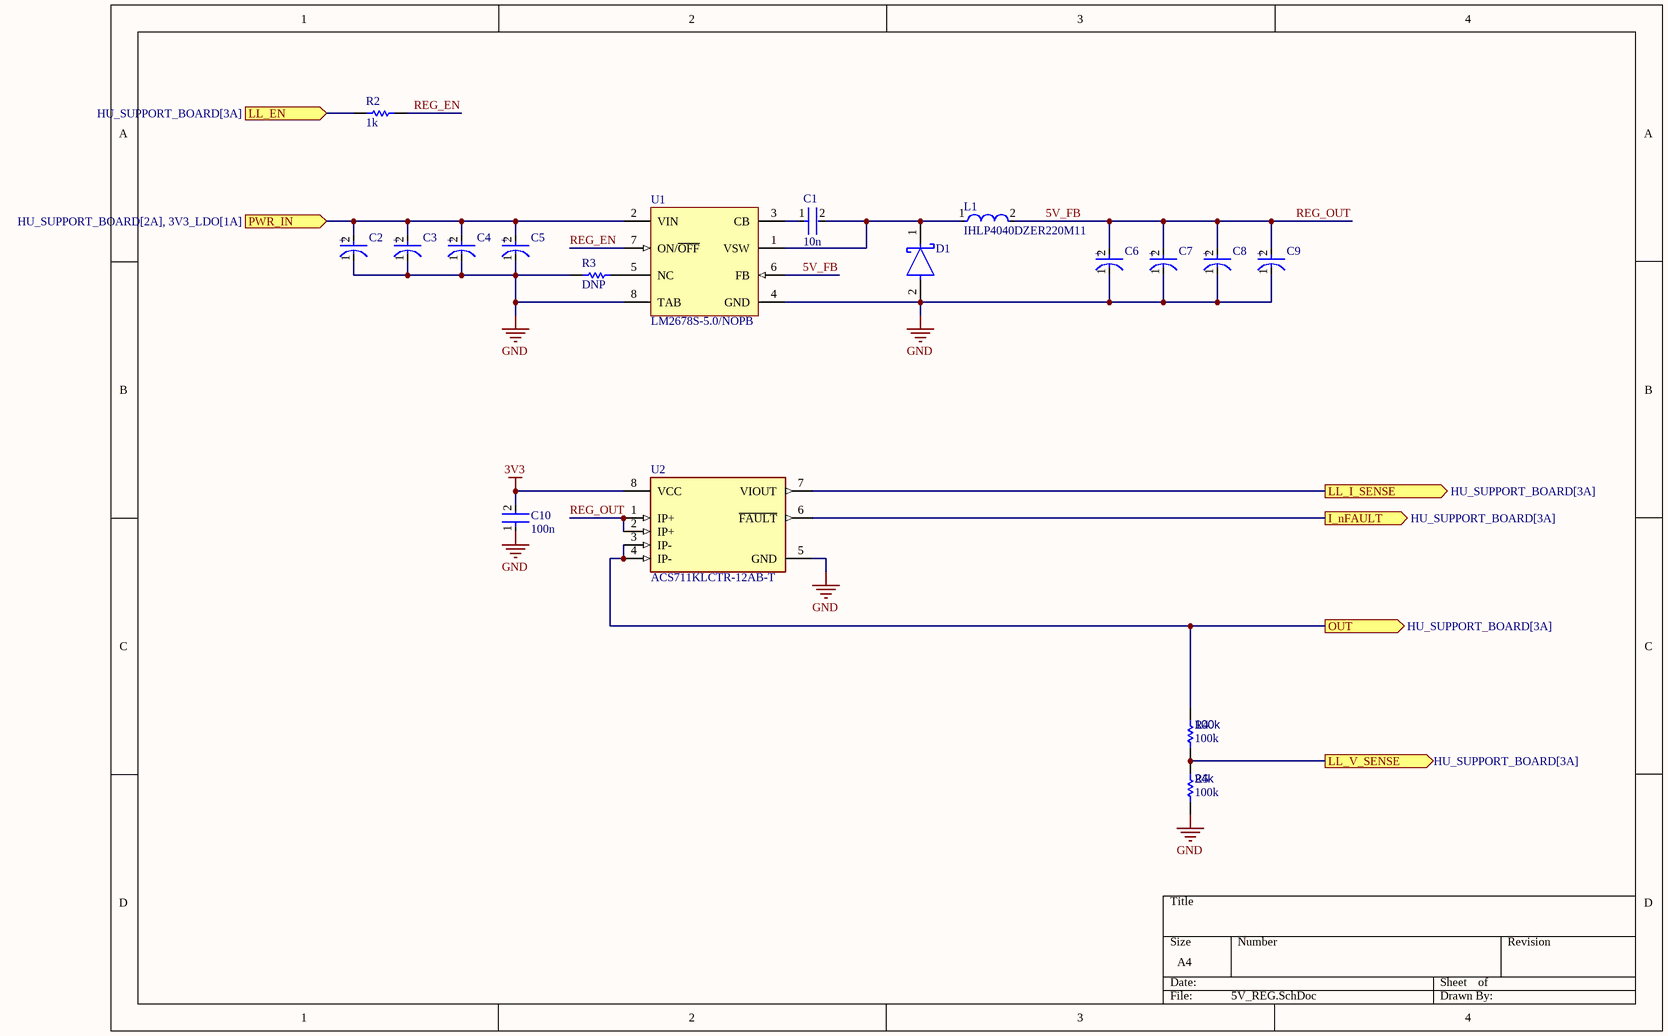
[diagram p3: 5V_REG.SchDoc]

### Parts
C1  10n  [FP-0402-L_1_0_0_05-W_0_5-IPC_A]
C2  TPSE686K025R0125  [FP-TPSE-MFG]  (value not drawn)
C3  TPSE686K025R0125  [FP-TPSE-MFG]  (value not drawn)
C4  TPSE686K025R0125  [FP-TPSE-MFG]  (value not drawn)
C5  TPSE686K025R0125  [FP-TPSE-MFG]  (value not drawn)
C6  25SVPF180M  [FP-OS-CON-SMT-E12-MFG]  (value not drawn)
C7  25SVPF180M  [FP-OS-CON-SMT-E12-MFG]  (value not drawn)
C8  TPSE686K025R0125  [FP-TPSE-MFG]  (value not drawn)
C9  TPSE686K025R0125  [FP-TPSE-MFG]  (value not drawn)
C10  100n  [FP-0402-L_1_0_0_05-W_0_5-IPC_A]
D1  B540C-13-F  [FP-SMC-MFG]  (value not drawn)
L1  IHLP4040DZER220M11  [FP-IHLP-4040DZ-FP_3_124x3-MFG]
R2  1k  [R0603B]
R3  DNP  [R0603B]
R4  100k  [R0603B]
R5  100k  value 24k  [R0603B]
U1  LM2678S-5.0/NOPB  [KTW0007B_L]
U2  ACS711KLCTR-12AB-T  [FP-LC-8-IPC_C]

### Ports
I_nFAULT (out, see HU_SUPPORT_BOARD[3A]), LL_EN (in, see HU_SUPPORT_BOARD[3A]), LL_I_SENSE (out, see HU_SUPPORT_BOARD[3A]), LL_V_SENSE (out, see HU_SUPPORT_BOARD[3A]), OUT (out, see HU_SUPPORT_BOARD[3A]), PWR_IN (in, see HU_SUPPORT_BOARD[2A], 3V3_LDO[1A])

### Nets
3V3: C10.2 U2.8(VCC)
GND: C2.1(C) C3.1(C) C4.1(C) C5.1(C) C6.1(C) C7.1(C) C8.1(C) C9.1(C) C10.1 D1.2(A) R3.2 R5.1 U1.4(GND) U1.8(TAB) U2.5(GND)
5V_FB: C6.2(A) C7.2(A) C8.2(A) C9.2(A) L1.2 U1.6(FB) U2.1(IP+) U2.2(IP+)  [also labelled REG_OUT]
I_nFAULT: U2.6(~{FAULT}) ; port I_nFAULT
LL_EN: R2.2 ; port LL_EN
LL_I_SENSE: U2.7(VIOUT) ; port LL_I_SENSE
LL_V_SENSE: R4.1 R5.2 ; port LL_V_SENSE
OUT: R4.2 U2.3(IP-) U2.4(IP-) ; port OUT
PWR_IN: C2.2(A) C3.2(A) C4.2(A) C5.2(A) U1.2(VIN) ; port PWR_IN
REG_EN: R2.1 U1.7(ON/~{OFF})
NetC1_1: C1.1 U1.3(CB)
NetC1_2: C1.2 D1.1(C) L1.1 U1.1(VSW)
NetR3_1: R3.1 U1.5(NC)

### Channels
5V_REG_0: designators end in _5V_REG_0; ports I_nFAULT=NetU2_5V_REG_0_6 LL_EN=3V3 LL_I_SENSE=NetU2_5V_REG_0_7 LL_V_SENSE=NetR4_5V_REG_0_1 OUT=5VA PWR_IN=PoC_PWR
5V_REG_1: designators end in _5V_REG_1; ports I_nFAULT=NetU2_5V_REG_1_6 LL_EN=5VB_LL_EN LL_I_SENSE=NetU2_5V_REG_1_7 LL_V_SENSE=NetR4_5V_REG_1_1 OUT=5VB PWR_IN=PoC_PWR

### Notes on the sheet
- (in symbol CMP-04424-000178-1) +
- (in symbol CMP-05428-001075-1) +

### Library data of the parts
C1 C10 = CMP-001-00058-1: as C45 on sheet TCAN1146_PWR_MGMT; Min Operating Temperature: -55°C; Mounting Technology: Surface Mount; Pins: 2; Case/Package: 0402; RoHS Compliant: Yes; Max Operating Temperature: 85°C
C2-C5 C8 C9 = CMP-04424-000178-1: CAP TANT 68UF 10% 25V 2917; Leakage Current: 17uA; Dielectric Material: Tantalum; Dissipation Factor: 6%; Ripple Current: 460uA; Polarity: Polar; ESR (Equivalent Series Resistance): 125mR; Mount: Surface Mount; Voltage Rating: 25V; Min Operating Temperature: -55°C; Case Code (Imperial): 2917; RoHS Compliant: Yes; Depth: 4.3mm; Lead Free: Lead Free; Number of Pins: 2; Width: 4.3mm; Series: TPS; Radiation Hardening: No; Height - Seated (Max): 0.169inch; Capacitance: 68uF; Case Code (Metric): 7343; Length: 7.3mm; Max Operating Temperature: 125°C; Packaging: Tape and Reel; Case/Package: 2917; Package Quantity: 1; Features: General Purpose; Voltage: 25V; REACH SVHC: No SVHC; Tolerance: 10%; Voltage Rating (DC): 25V; Height: 4.1mm; Termination: SMD/SMT
C6 C7 = CMP-05428-001075-1: Conductive Polymer Aluminum Solid Capacitors (OS-CON) 180uF ±20% 25V; Polarity: Polar; Ripple Current (AC): 4.65A; Dissipation Factor: 12%; ESR (Equivalent Series Resistance): 16mR; Life (Hours): 5000Hour; Leakage Current: 900uA; Voltage Rating (DC): 25V; Height: 11.9mm; REACH SVHC: No SVHC; Number of Pins: 12; Series: OS-CON™, SVPF; Length: 11.9mm; Packaging: Tape and Reel; Case/Package: Radial; Diameter: 8mm; Voltage: 25V; Lead Free: Lead Free; Height - Seated (Max): 0.472inch; Ripple Current: 4.65A; Package Quantity: 400; Tolerance: 20%; Max Operating Temperature: 105°C; RoHS Compliant: Yes; Mount: Surface Mount; Termination: SMD/SMT; Voltage Rating: 25V; Capacitance: 180uF; Min Operating Temperature: -55°C
D1 = CMP-2000-05097-3: DIODE SCHOTTKY 40V 5A SMC; Manufacturer: Diodes Inc.; Automotive Grade: NA; Peak Reverse Current: 0.5mA; Value: 300pF; Max Junction Temp: +150°C; Max Surge Forward Current: 100A; Standoff Height: 0.1mm; Digikey Description: DIODE SCHOTTKY 40V 5A SMC; Temperature Range Low: -55°C; Manufacturer Part Number: B540C-13-F; Octopart: https://octopart.com/b540c-13-f-diodes+inc.-325873; Lead Free: Yes; Reverse Voltage: 40V; RoHS: TRUE; Category: Diode; Mouser Description: Diode: Schottky rectifying; SMD; 40V; 5A; SMC; Package: reel, tape; ComponentLink2Description: Datasheet; Temperature Range High: +150°C; Automotive: No; Footprint Url: https://www.diodes.com/assets/Package-Files/SMC.pdf; Device Class L3: Schottky Diodes; Height: 2.5mm; Forward Current: 5A; Temperature: -55°C to +150°C; Package: SMC; ComponentLink2URL: https://www.diodes.com/assets/Datasheets/ds13012.pdf; Device Class L2: Diodes; Max Repetitive Reverse Voltage: 40V; Device Class L1: Discrete Semiconductors; Capacitance: 300pF
L1 = CMP-02424-000785-1: Commercial Inductors, Low DCR Series 22uH 5A 66mΩ 20%; Shielding: Shielded; Max DC Current: 4.5A; Test Frequency: 100kHz; DC Resistance (DCR): 66mR; Self Resonant Frequency: 1MHz; Core Material: Metal; Series: IHLP-4040DZ-11; Min Operating Temperature: -55°C; Rated Current-Max: 5A; Current Rating: 5A; Military Standard: Not; Depth: 10.3mm; Height - Seated (Max): 0.157inch; Contact Plating: Tin; Termination: SMD/SMT; Length: 0.43inch; Package Quantity: 1; Width: 0.405inch; Inductance Tolerance: 20%; Tolerance: 20%; Height: 4mm; RMS Current (Irms): 5A; Saturation Current: 4.5A; Inductance: 22uH; Mount: Surface Mount; Max Operating Temperature: 125°C; Case/Package: 4040; Packaging: Tape and Reel; Radiation Hardening: No; RoHS Compliant: Yes; Lead Free: Lead Free
R2 R4 R5 = CMP-009-00002-14: Resistor
  R2: Value: 1k
  R4: Value: 100k
R3 = CMP-009-00002-14: Resistor; Value: 1k
U1 = CMP-0069-00189-3: SIMPLE SWITCHER® High Efficiency 5A Step-Down Voltage Regulator, 7-pin TO-263, Pb-Free; Manufacturer: Texas Instruments; PackageTopMarking: NSUZXYTTE#*LM2678*S-5.0; PowerWise: N; PackageReference: KTW0007B; RoHS: Y; ComponentLink1URL: http://www.ti.com/general/docs/lit/getliterature.tsp?genericPartNumber=LM2678&fileType=pdf; ComponentLink1Description: Datasheet URL; PackageDescription: TO-263, Molded, .400 x .390 x .180in Body, 7 Lead, .050in Pitch, Surface Mount; Code_JEDEC: MO-169-AC; PinCount: 7; CompType: Switcher
U2 = CMP-1557-00012-2: SENSOR CURRENT HALL 12.5A AC/DC; Number of Channels: 1; Min Supply Voltage: 3V; Sensitivity: 110mV/A; Response Time: 4.6us; Operating Supply Voltage: 3.3V; Max Supply Voltage: 5.5V; Max Supply Current: 5.5mA; Bandwidth: 100kHz; Linearity: 1%; Quiescent Current: 4mA; Accuracy: 5%; Polarity: Bidirectional; Case/Package: SOIC; Packaging: Tape and Reel; Number of Pins: 8; Width: 3.9mm; Frequency: 100kHz; -3db Bandwidth: 100kHz; REACH SVHC: No SVHC; Series: -; Height: 1.5mm; Package Quantity: 1; Min Operating Temperature: -40°C; Max Operating Temperature: 125°C; Current Sensing: 12.5A; RoHS Compliant: Yes; Length: 4.9mm

## Sheet GMSL_DESERIALIZER.SchDoc
size C; SheetNumber: 3; SheetTotal: 7
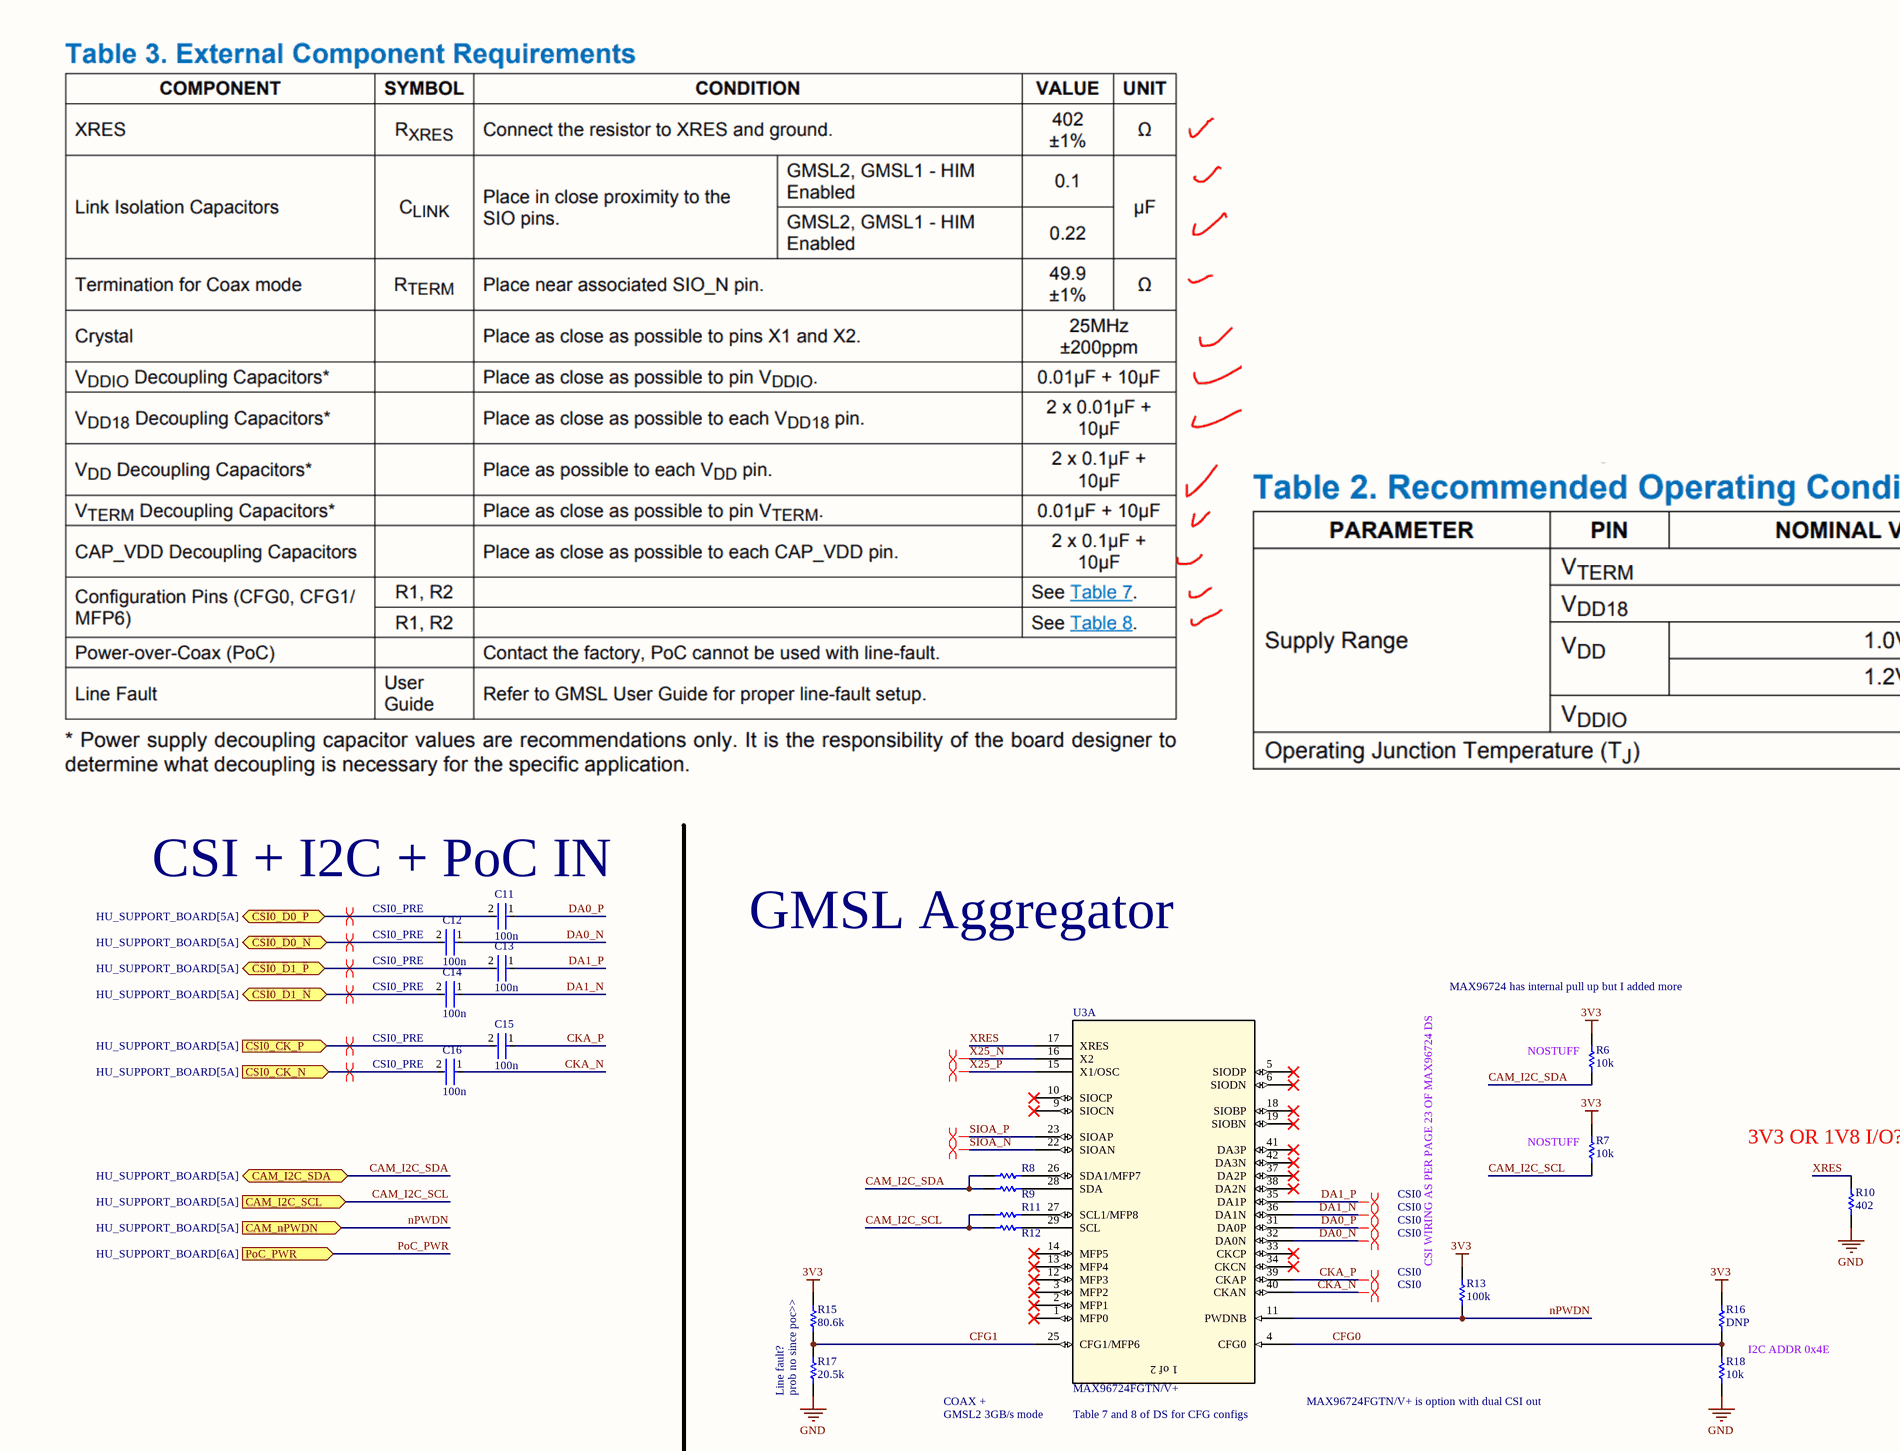
[diagram p4: GMSL_DESERIALIZER.SchDoc, top left]
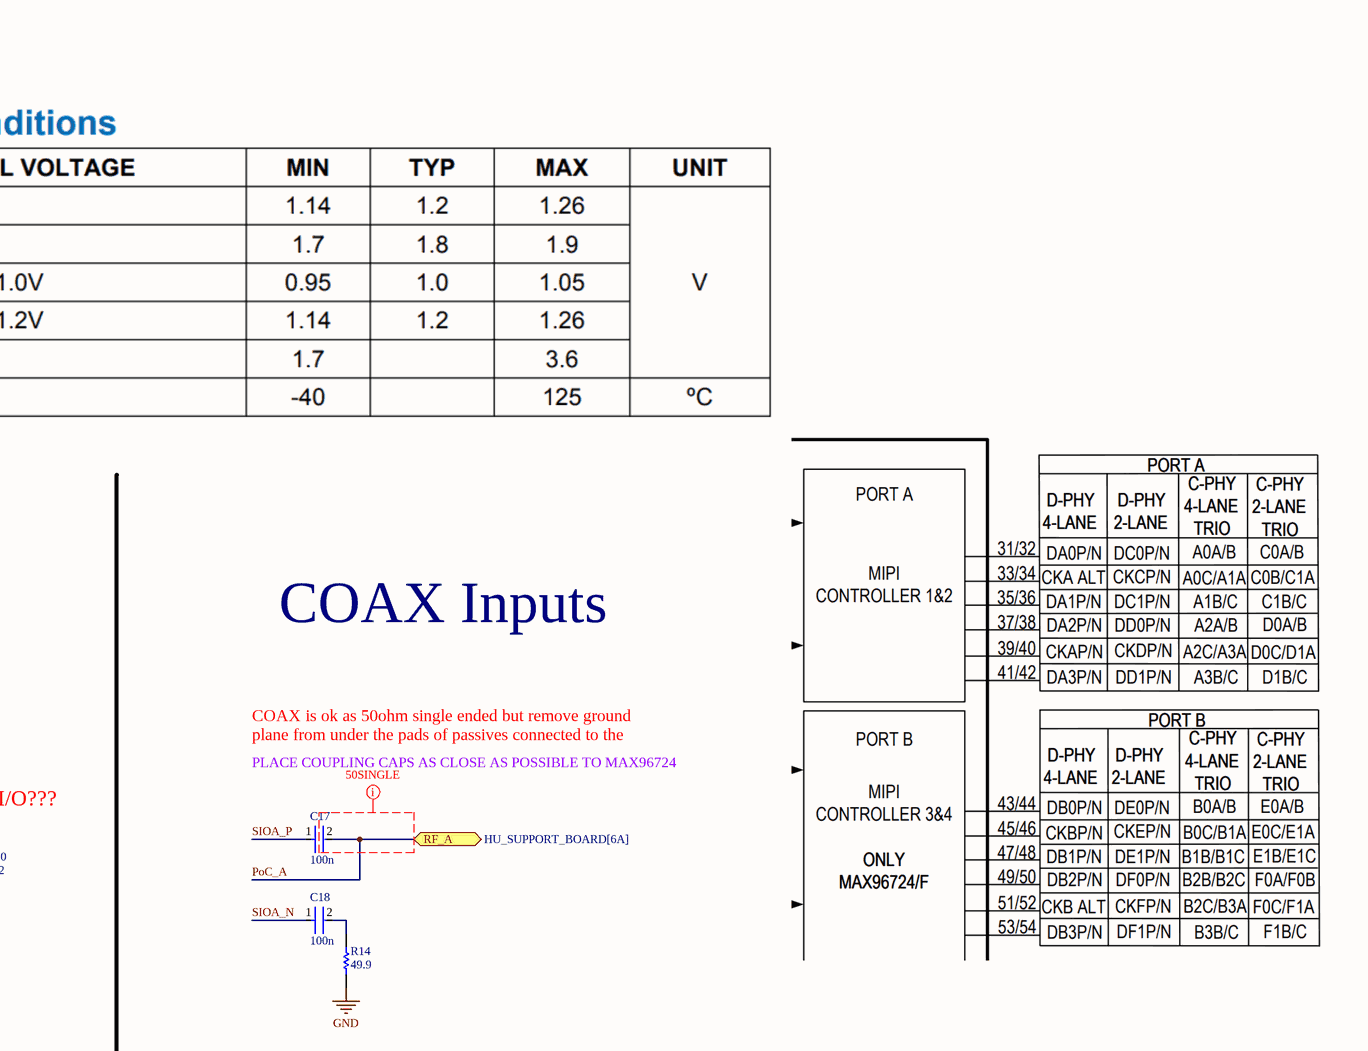
[diagram p5: GMSL_DESERIALIZER.SchDoc, top right]
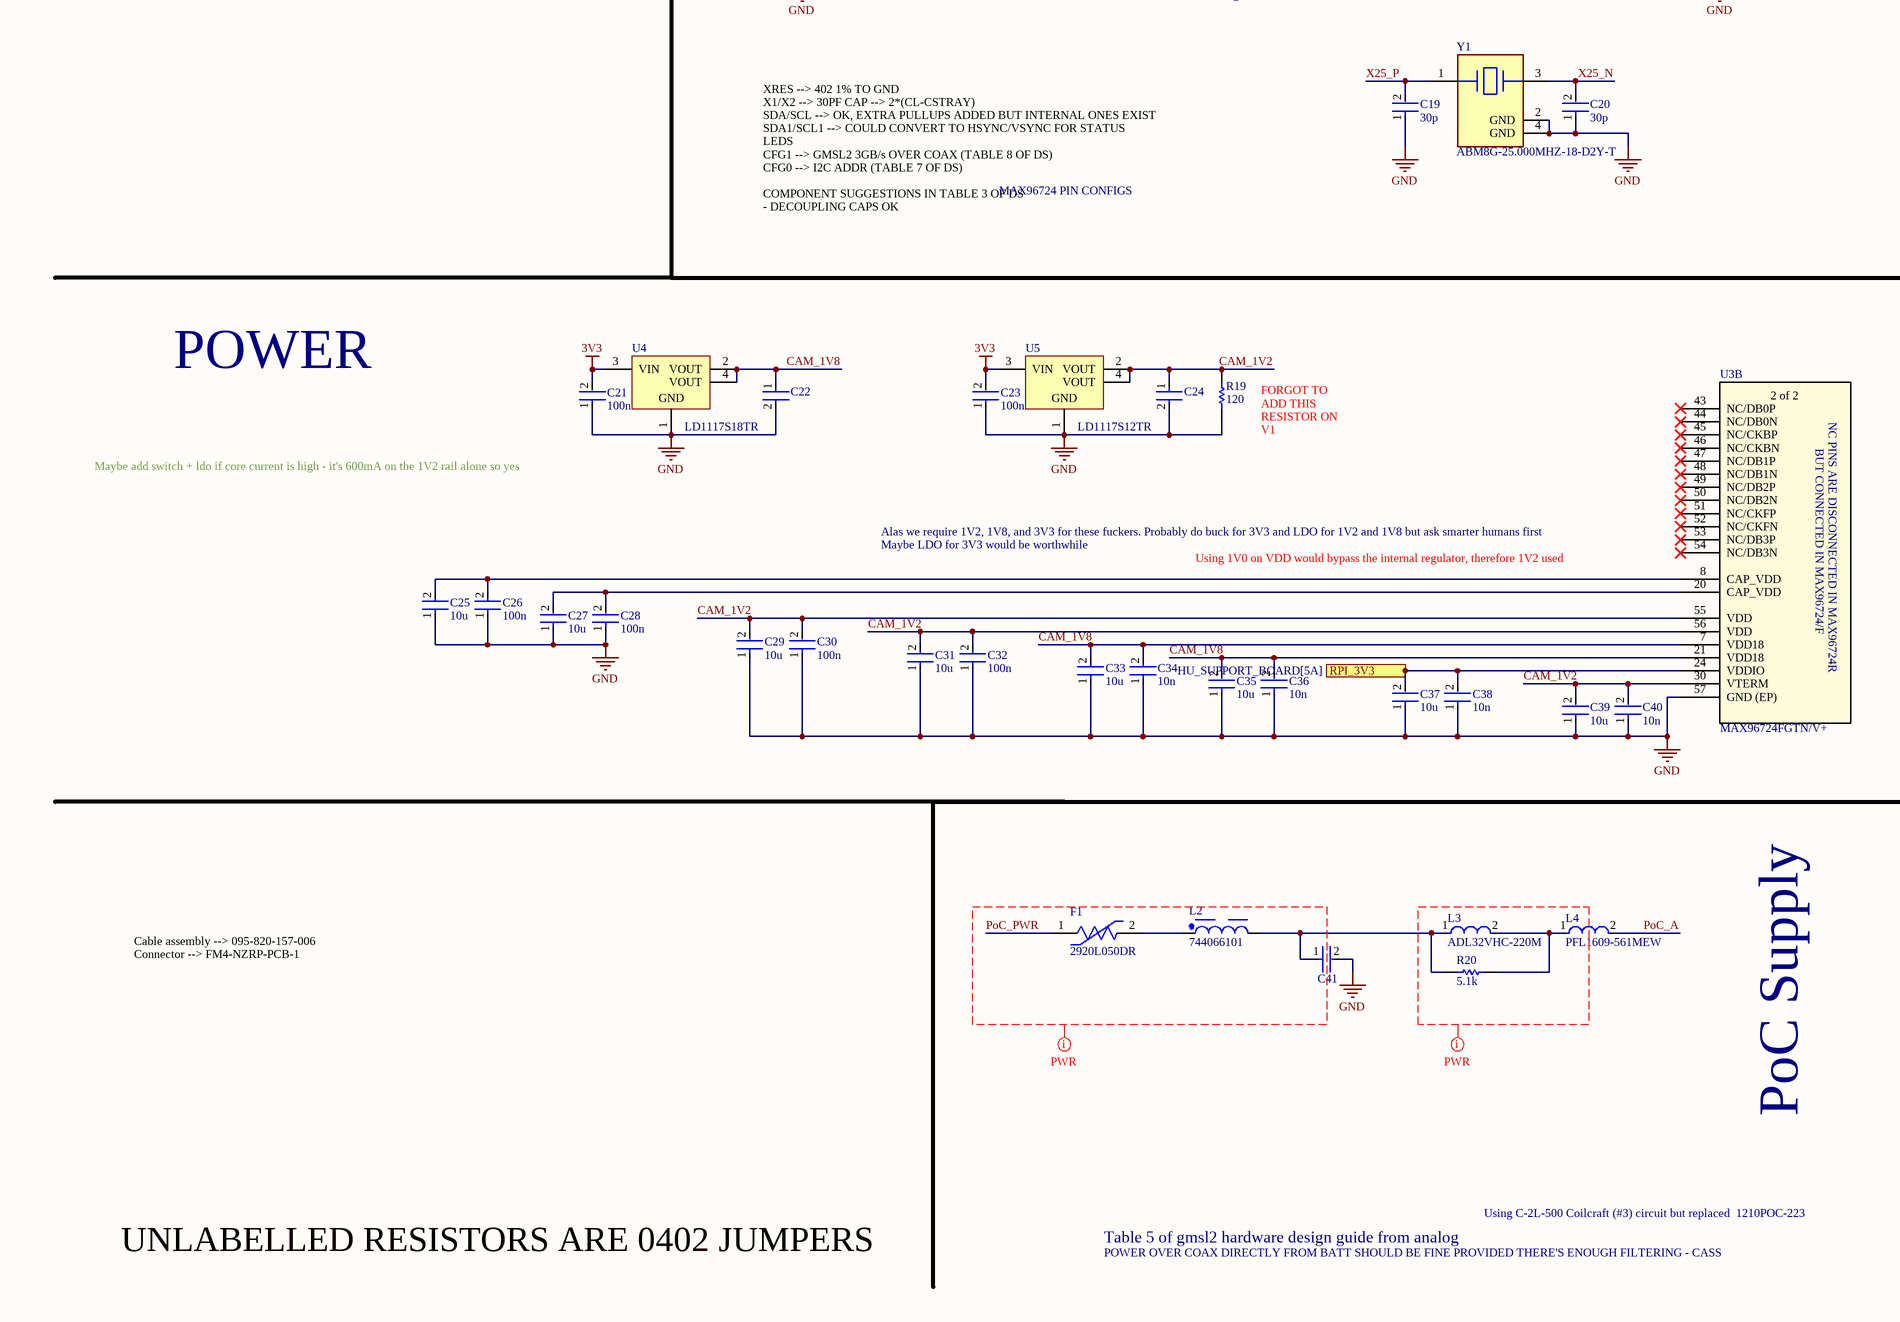
[diagram p6: GMSL_DESERIALIZER.SchDoc, bottom left]
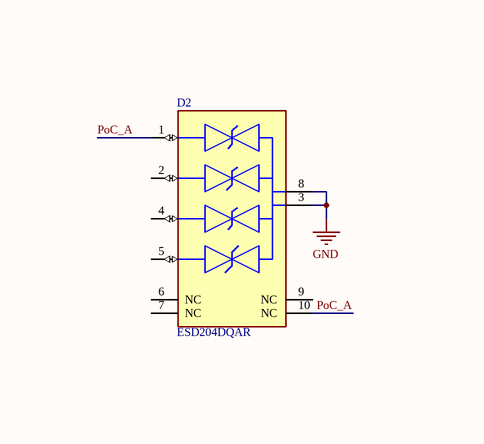
[diagram p7: GMSL_DESERIALIZER.SchDoc, bottom right]

### Parts
C11  100n  [FP-0402-L_1_0_0_05-W_0_5-IPC_A]
C12  100n  [FP-0402-L_1_0_0_05-W_0_5-IPC_A]
C13  100n  [FP-0402-L_1_0_0_05-W_0_5-IPC_A]
C14  100n  [FP-0402-L_1_0_0_05-W_0_5-IPC_A]
C15  100n  [FP-0402-L_1_0_0_05-W_0_5-IPC_A]
C16  100n  [FP-0402-L_1_0_0_05-W_0_5-IPC_A]
C17  100n  [FP-0402-L_1_0_0_05-W_0_5-IPC_A]
C18  100n  [FP-0402-L_1_0_0_05-W_0_5-IPC_A]
C19  30p  [FP-0402-L_1_0_0_05-W_0_5-IPC_A]
C20  30p  [FP-0402-L_1_0_0_05-W_0_5-IPC_A]
C21  100n  [FP-0402-L_1_0_0_05-W_0_5-IPC_A]
C22  GRM188R60J106ME47D  [FP-GRM188-0_1-e0_2_0_55-IPC_A]  (value not drawn)
C23  100n  [FP-0402-L_1_0_0_05-W_0_5-IPC_A]
C24  GRM188R60J106ME47D  [FP-GRM188-0_1-e0_2_0_55-IPC_A]  (value not drawn)
C25  10u  [FP-0402-L_1_0_0_05-W_0_5-IPC_A]
C26  100n  [FP-0402-L_1_0_0_05-W_0_5-IPC_A]
C27  10u  [FP-0402-L_1_0_0_05-W_0_5-IPC_A]
C28  100n  [FP-0402-L_1_0_0_05-W_0_5-IPC_A]
C29  10u  [FP-0402-L_1_0_0_05-W_0_5-IPC_A]
C30  100n  [FP-0402-L_1_0_0_05-W_0_5-IPC_A]
C31  10u  [FP-0402-L_1_0_0_05-W_0_5-IPC_A]
C32  100n  [FP-0402-L_1_0_0_05-W_0_5-IPC_A]
C33  10u  [FP-0402-L_1_0_0_05-W_0_5-IPC_A]
C34  10n  [FP-0402-L_1_0_0_05-W_0_5-IPC_A]
C35  10u  [FP-0402-L_1_0_0_05-W_0_5-IPC_A]
C36  10n  [FP-0402-L_1_0_0_05-W_0_5-IPC_A]
C37  10u  [FP-0402-L_1_0_0_05-W_0_5-IPC_A]
C38  10n  [FP-0402-L_1_0_0_05-W_0_5-IPC_A]
C39  10u  [FP-0402-L_1_0_0_05-W_0_5-IPC_A]
C40  10n  [FP-0402-L_1_0_0_05-W_0_5-IPC_A]
C41  GRM21BR61E226ME44L  [FP-GRM21B-0_2-e0_2_0_7-IPC_B]  (value not drawn)
D2  ESD204DQAR  [FP-DQA0010A-MFG]
F1  2920L050DR  [FP-2920L050DR-MFG]
L2  744066101  [WE-TPC_1038]
L3  ADL32VHC-220M  [FP-1210POC-MFG]
L4  PFL1609-561MEW  [FP-PFL1609-MFG]
R6  10k  [R0603B]
R7  10k  [R0603B]
R8  0402 JUMPER  [RESC1005X40X25ML05T05]  (value not drawn)
R9  0402 JUMPER  [RESC1005X40X25ML05T05]  (value not drawn)
R10  402  [R0603B]
R11  0402 JUMPER  [RESC1005X40X25ML05T05]  (value not drawn)
R12  0402 JUMPER  [RESC1005X40X25ML05T05]  (value not drawn)
R13  100k  [R0603B]
R14  49.9  [R0603B]
R15  80.6k  [R0603B]
R16  DNP  [R0603B]
R17  20.5k  [R0603B]
R18  10k  [R0603B]
R19  120  [R0603B]
R20  5.1k  [R0603B]
U3  MAX96724FGTN/V+  [MAX96724FGTN_V+-Footprint-1]  (parts A,B of 2)
U4  LD1117S18TR  [SOT-223_M]
U5  LD1117S12TR  [SOT-223_M]
Y1  ABM8G-25.000MHZ-18-D2Y-T  [FP-ABM8G-MFG]

### Ports
CAM_I2C_SCL (in, see HU_SUPPORT_BOARD[5A]), CAM_I2C_SDA (bidir, see HU_SUPPORT_BOARD[5A]), CAM_nPWDN (in, see HU_SUPPORT_BOARD[5A]), CSI0_CK_N (in, see HU_SUPPORT_BOARD[5A]), CSI0_CK_P (in, see HU_SUPPORT_BOARD[5A]), CSI0_D0_N (bidir, see HU_SUPPORT_BOARD[5A]), CSI0_D0_P (bidir, see HU_SUPPORT_BOARD[5A]), CSI0_D1_N (bidir, see HU_SUPPORT_BOARD[5A]), CSI0_D1_P (bidir, see HU_SUPPORT_BOARD[5A]), PoC_PWR (in, see HU_SUPPORT_BOARD[6A]), RF_A (bidir, see HU_SUPPORT_BOARD[6A]), RPI_3V3 (in, see HU_SUPPORT_BOARD[5A])

### Nets
3V3: C21.2 C23.2 R6.2 R7.2 R13.2 R15.2 R16.2 U4.3(VIN) U5.3(VIN)
GND: C19.1 C20.1 C21.1 C22.2 C23.1 C24.2 C25.1 C26.1 C27.1 C28.1 C29.1 C30.1 C31.1 C32.1 C33.1 C34.1 C35.1 C36.1 C37.1 C38.1 C39.1 C40.1 C41.2 D2.3(GND) D2.8(GND) R10.1 R14.1 R17.1 R18.1 R19.2 U3.57(GND_(EP)) U4.1(GND) U5.1(GND) Y1.2(GND) Y1.4(GND)
PoC_PWR: F1.1 ; port PoC_PWR
CAM_1V2: C24.1 C29.2 C30.2 C31.2 C32.2 C39.2 C40.2 R19.1 U3.30(VTERM) U3.55(VDD) U3.56(VDD) U5.2(VOUT) U5.4(VOUT)
CAM_1V8: C22.1 C33.2 C34.2 C35.2 C36.2 U3.7(VDD18) U3.21(VDD18) U4.2(VOUT) U4.4(VOUT)
CAM_I2C_SCL: R7.1 R11.1 R12.1 ; port CAM_I2C_SCL
CAM_I2C_SDA: R6.1 R8.1 R9.1 ; port CAM_I2C_SDA
CFG0: R16.1 R18.2 U3.4(CFG0)
CFG1: R15.1 R17.2 U3.25(CFG1/MFP6)
CKA_N: C16.1 U3.40(CKAN)
CKA_P: C15.1 U3.39(CKAP)
CSI_CLK_N: C16.2 ; port CSI0_CK_N
CSI_CLK_P: C15.2 ; port CSI0_CK_P
CSI_D0_N: C12.2 ; port CSI0_D0_N
CSI_D0_P: C11.2 ; port CSI0_D0_P
CSI_D1_N: C14.2 ; port CSI0_D1_N
CSI_D1_P: C13.2 ; port CSI0_D1_P
DA0_N: C12.1 U3.32(DA0N)
DA0_P: C11.1 U3.31(DA0P)
DA1_N: C14.1 U3.36(DA1N)
DA1_P: C13.1 U3.35(DA1P)
nPWDN: R13.1 U3.11(PWDNB) ; port CAM_nPWDN  [project net CAM_nPWDN]
PoC_A: C17.2 D2.1(IO1) D2.10(NC) L4.2 ; port RF_A
RPI_3V3: C37.2 C38.2 U3.24(VDDIO) ; port RPI_3V3
SIOA_N: C18.1 U3.22(SIOAN)
SIOA_P: C17.1 U3.23(SIOAP)
X25_N: C20.2 U3.16(X2) Y1.3
X25_P: C19.2 U3.15(X1/OSC) Y1.1
XRES: R10.2 U3.17(XRES)
NetC18_2: C18.2 R14.2
NetC25_2: C25.2 C26.2 U3.8(CAP_VDD)
NetC27_2: C27.2 C28.2 U3.20(CAP_VDD)
NetC41_1: C41.1 L2.2 L3.1 R20.2
NetF1_2: F1.2 L2.1
NetL3_2: L3.2 L4.1 R20.1
NetR8_2: R8.2 U3.26(SDA1/MFP7)
NetR9_2: R9.2 U3.28(SDA)
NetR11_2: R11.2 U3.27(SCL1/MFP8)
NetR12_2: R12.2 U3.29(SCL)

Not connected (* = marked no-connect by the designer): D2 2(IO2) 4(IO3) 5(IO4) 6(NC) 7(NC) 9(NC); U3 1(MFP0)* 2(MFP1)* 3(MFP2)* 5(SIODP)* 6(SIODN)* 9(SIOCN)* 10(SIOCP)* 12(MFP3)* 13(MFP4)* 14(MFP5)* 18(SIOBP)* 19(SIOBN)* 33(CKCP)* 34(CKCN)* 37(DA2P)* 38(DA2N)* 41(DA3P)* 42(DA3N)* 43(NC/DB0P)* 44(NC/DB0N)* 45(NC/CKBP)* 46(NC/CKBN)* 47(NC/DB1P)* 48(NC/DB1N)* 49(NC/DB2P)* 50(NC/DB2N)* 51(NC/CKFP)* 52(NC/CKFN)* 53(NC/DB3P)* 54(NC/DB3N)*

### Layout directives
differential pair; differential pair class 100DIFF: SIOA_N, SIOA_P
differential pair: X25_N, X25_P
net class PWR: (no net found under the mark), PoC_PWR
differential pair; differential pair class CSI0: CKA_N, CKA_P, DA0_N, DA0_P, DA1_N, DA1_P
differential pair; differential pair class CSI0_PRE: CSI_CLK_N, CSI_CLK_P, CSI_D0_N, CSI_D0_P, CSI_D1_N, CSI_D1_P
net class 50SINGLE: (no net found under the mark)

### Notes on the sheet
- (near C11) CSI + I2C + PoC IN
- GMSL Aggregator
- MAX96724 has internal pull up but I added more
- COAX Inputs
- (near R6) NOSTUFF
- COAX is ok as 50ohm single ended but remove ground plane from under the pads of passives connected to the GMSL trace
- PLACE COUPLING CAPS AS CLOSE AS POSSIBLE TO MAX96724
- (near R7) NOSTUFF
- (near R10) 3V3 OR 1V8 I/O???
- (near R13) CSI WIRING AS PER PAGE 23 OF MAX96724 DS
- Line fault?
- prob no since poc>>
- I2C ADDR 0x4E
- GMSL2 3GB/s mode
- COAX +
- Table 7 and 8 of DS for CFG configs
- MAX96724FGTN/V+ is option with dual CSI out
- XRES --> 402 1% TO GND
  X1/X2 --> 30PF CAP --> 2*(CL-CSTRAY)
  SDA/SCL --> OK, EXTRA PULLUPS ADDED BUT INTERNAL ONES EXIST
  SDA1/SCL1 --> COULD CONVERT TO HSYNC/VSYNC FOR STATUS LEDS
  CFG1 --> GMSL2 3GB/s OVER COAX (TABLE 8 OF DS)
  CFG0 --> I2C ADDR (TABLE 7 OF DS)
  COMPONENT SUGGESTIONS IN TABLE 3 OF DS
  - DECOUPLING CAPS OK
- MAX96724 PIN CONFIGS
- POWER
- (near R19) FORGOT TO ADD THIS RESISTOR ON V1
- Maybe add switch + ldo if core current is high - it's 600mA on the 1V2 rail alone so yes
- Alas we require 1V2, 1V8, and 3V3 for these fuckers. Probably do buck for 3V3 and LDO for 1V2 and 1V8 but ask smarter humans first
- Maybe LDO for 3V3 would be worthwhile
- Using 1V0 on VDD would bypass the internal regulator, therefore 1V2 used
- Cable assembly --> 095-820-157-006
  Connector --> FM4-NZRP-PCB-1
- PoC Supply
- Using C-2L-500 Coilcraft (#3) circuit but replaced  1210POC-223
- UNLABELLED RESISTORS ARE 0402 JUMPERS
- Table 5 of gmsl2 hardware design guide from analog
- POWER OVER COAX DIRECTLY FROM BATT SHOULD BE FINE PROVIDED THERE'S ENOUGH FILTERING - CASS
- (in symbol CMP-015-00011-3, part A) 1 of 2
- (in symbol CMP-015-00011-3, part B) 2 of 2; NC PINS ARE DISCONNECTED IN MAX96724R; BUT CONNECTED IN MAX96724/F

### Library data of the parts
C11-C16 C19-C21 C23 C25-C40 = CMP-001-00058-1: as C45 on sheet TCAN1146_PWR_MGMT; Min Operating Temperature: -55°C; Mounting Technology: Surface Mount; Pins: 2; Case/Package: 0402; RoHS Compliant: Yes; Max Operating Temperature: 85°C
  C11-C16 C21 C23 C26 C28 C30 C32: Value: 100n
  C19 C20: Value: 30p
  C25 C27 C29 C31 C33 C35 C37 C39: Value: 10u
  C34 C36 C38 C40: Value: 10n
C17 C18 = CMP-001-00058-1: LARGE PADS, 0402 CAP, CHANGE COMMENT TO MATCH REAL P/N; Capacitor Type: Ceramic; Value: 220n; Min Operating Temperature: -55°C; Mounting Technology: Surface Mount; Pins: 2; Case/Package: 0402; RoHS Compliant: Yes; Max Operating Temperature: 85°C
C22 C24 = CMP-2006-02792-2: Chip Multilayer Ceramic Capacitors for General Purpose, 0603, 10uF, X5R, 15%, 20%, 6.3V; Packaging: Tape and Reel; Voltage Rating (DC): 6.3V; Width: 0.031inch; Termination: SMD/SMT; Dielectric: X5R; Package Quantity: 4000; Voltage Rating: 6.3V; Capacitance: 10uF; Case/Package: 0603; Min Operating Temperature: -55°C; Voltage: 6.3V; Length: 1.6mm; Thickness: 0.035inch; Lead Free: Lead Free; Depth: 0.8mm; Case Code (Imperial): 0603; Max Operating Temperature: 85°C; Material: Ceramic; Height: 0.8mm; Tolerance: 20%; Mount: Surface Mount; REACH SVHC: No SVHC; Radiation Hardening: No; Case Code (Metric): 1608
C41 = CMP-2007-03222-3: Chip Multilayer Ceramic Capacitors for General Purpose, 0805, 22uF, X5R, 15%, 20%, 25V; Case/Package: 0805; Depth: 1.25mm; Resistor Type: Ceramic; Voltage Rating: 25V; Lead Free: Lead Free; Voltage Rating (DC): 25V; Case Code (Metric): 2012; Thickness: 0.057inch; REACH SVHC: No SVHC; Material: Ceramic; Tolerance: 20%; Length: 2mm; Capacitance: 22uF; Case Code (Imperial): 0805; Max Operating Temperature: 85°C; Termination: SMD/SMT; Weight: 0.000335oz; Dielectric: X5R; Packaging: Tape and Reel; Voltage: 25V; Package Quantity: 3000; Height: 1.25mm; Mount: Surface Mount; Width: 1.25mm; Min Operating Temperature: -55°C
D2 = CMP-04989-000002-1: 4-CHANNEL LOW-CAPACITANCE SURGE; Manufacturer: Texas Instruments; Value: 0.55pF; Reverse Standoff Voltage: 3.6V; Standoff Height: 0mm; Breakdown Voltage: 5.5V; Peak Pulse Current: 5.5A; Clamping Voltage: 11.5V; Direction: Bidirectional; Peak Pulse Power: 50W; Number Of Channels: 4; Ambient Temperature Range High: +125°C; ComponentLink2Description: Datasheet; Height: 0.55mm; Lead Free: Yes; Device Class L3: unset; Temperature Range High: +125°C; Temperature Range Low: -40°C; Package: DQA0010A; Temperature: -40°C to +125°C; Capacitance: 0.55pF; RoHS: TRUE; Mouser Description: 4-Channel Low-Capacitance Surge and ESD Protection Diode 10-USON -40 to 125; Category: Diode; Device Class L1: Circuit Protection; Octopart: https://octopart.com/esd204dqar-texas+instruments-89917476; Device Class L2: TVS Diodes; Ambient Temperature Range Low: -40°C; Manufacturer Part Number: ESD204DQAR; ComponentLink2URL: http://www.ti.com/lit/ds/symlink/esd204.pdf; Automotive: No; Digikey Description: 4-CHANNEL LOW-CAPACITANCE SURGE
F1 = CMP-08606-000071-1: as F2 on sheet HU_SUPPORT_BOARD; Operating Supply Voltage: 60V; Termination: SMD/SMT; Width: 5.44mm; Case/Package: 2920; Series: 2920L; Case Code (Imperial): 2920; Height: 1.25mm; Hold Current: 500mA; Terminal Material: Copper; Min Operating Temperature: -40°C; Package Quantity: 1500; Max Voltage Rating (DC): 60V; RoHS Compliant: Yes; Case Code (Metric): 7351; Lead Free: Lead Free; Max Operating Temperature: 85°C; Voltage Rating (DC): 60V; Working Voltage: 60V; Length: 7.98mm; REACH SVHC: No SVHC; Max Current Rating: 10A; Voltage Rating: 60V; Packaging: Tape and Reel
L2 = CMP-0227-00094-3: NexarPartId: 8917123; Current Rating: 1.2A; Shielding: Shielded; Core Material: Ferrite; Inductance: 100µH; Test Frequency: 100kHz; Tolerance: 30%; Resistance: 255mΩ; Self Resonant Frequency: 6MHz; Composition: Wirewound; Packaging: Cut Tape (CT); REACH SVHC: Unknown; Number of Pins: 2; Max DC Current: 1.2A; Saturation Current: 1.2A; Ambient Temperature Range High: 95°C; Weight: 1.273007g; Height: 3.8mm; Width: 10mm; Min Operating Temperature: -40°C; Max Operating Temperature: 125°C; Termination: SMD/SMT; Height - Seated (Max): 4.0894mm; Length: 10mm; RMS Current (Irms): 1.2A; Ambient Temperature Range Low: -40°C; RoHS: Compliant; Mount: Surface Mount; Depth: 10mm; DC Resistance (DCR): 255mΩ; Inductance Tolerance: 30%; Case/Package: Nonstandard
L3 = CMP-11268-000041-1: NOT COILCRAFT - ACTUAL P# --> ADL32VHC-220M / - Power Injection Chokes for PoC; Manufacturer Part Number: 1210POC-223MRC; Value: 22uH; Core Material: Ferrite; Saturation Current: 720mA; Series Resistance: 0.88Ω; Rms Current: 700mA; Automotive Grade: Grade 1; Self Resonant Frequency: 70MHz; Test Frequency: 100kHz; Tolerance: 20%; Ambient Temperature Range High: +125°C; Manufacturer: coilcraft; Octopart: https://octopart.com/1210poc-223mrc-coilcraft-103207315; Category: Ind; Device Class L2: Inductors; RoHS: TRUE; Device Class L3: Fixed Inductors; Package: 1210POC; Ambient Temperature Range Low: -40°C; ComponentLink2URL: https://drive.google.com/open?id=15FlOq8Y4YbRFohfA_cJ40jgnqs8va2Mh; Lead Free: Yes; Inductance: 22uH; Device Class L1: Passive Components; ComponentLink2Description: Datasheet; Automotive: Yes; Height: 3mm
L4 = CMP-11268-000007-1: Fixed Inductors PFL1609 Low Profile 0.56 uH 20 % 1.4 A; Manufacturer: coilcraft; Rms Current: 1100mA; Self Resonant Frequency: 600MHz; Core Material: Composite; Tolerance: 20%; Value: 0.56uH; Automotive Grade: Grade 1; Saturation Current: 710mA; Test Frequency: 7.9MHz; Shielding: true; Series Resistance: 130mΩ; Lead Free: Yes; Device Class L1: Passive Components; Package: PFL1609; Octopart: https://octopart.com/pfl1609-561mew-coilcraft-20329171; ComponentLink2URL: https://www.coilcraft.com/pdfs/pfl1609.pdf; Manufacturer Part Number: PFL1609-561MEW; Ambient Temperature Range Low: -40°C; Composition: Wirewound; Inductance: 0.56uH; Device Class L2: Inductors; Category: Ind; Device Class L3: Fixed Inductors; Mouser Description: Fixed Inductors PFL1609 Low Profile 0.56 uH 20 % 1.4 A; Automotive: Yes; ComponentLink2Description: Datasheet; Ambient Temperature Range High: +105°C; Height: 0.95mm; RoHS: TRUE
R6 R7 R10 R13-R20 = CMP-009-00002-14: Resistor
R8 R9 R11 R12 = CMP-009-00118-2: READ THE NAME; Pins: 2; Component Type: Standard; Design Item ID: CMP-009-00206-2; Source: 0402jump.SchLib
U3 = CMP-015-00011-3: Quad Tunneling GMSL2/1 to CSI-2 Deserializer
U4 = CMP-0244-00308-1: Fixed Low Drop Positive Voltage Regulator, 1.8V, 4-Pin SOT-223, Tape and Reel; ComponentLink1URL: http://www.st.com; PackageReference: SOT-223; PackageDescription: 4-Pin SOT-223 Package, 6.5 x 3.5 mm Body, 2.3 mm Pitch, 7 mm Lead Span; ComponentLink2URL: http://www.st.com/internet/com/TECHNICAL_RESOURCES/TECHNICAL_LITERATURE/DATASHEET/CD00000544.pdf; ComponentLink2Description: Datasheet; ComponentLink1Description: Manufacturer URL; DatasheetVersion: 1/11/2011; PackageVersion: 2010
U5 = CMP-0244-00318-1: Fixed Low Drop Positive Voltage Regulator, 1.2V, 4-Pin SOT-223, Tape and Reel; PackageDescription: 4-Pin SOT-223 Package, 6.5 x 3.5 mm Body, 2.3 mm Pitch, 7 mm Lead Span; PackageVersion: 2010; ComponentLink2Description: Datasheet; PackageReference: SOT-223; ComponentLink2URL: http://www.st.com/internet/com/TECHNICAL_RESOURCES/TECHNICAL_LITERATURE/DATASHEET/CD00000544.pdf; ComponentLink1Description: Manufacturer URL; DatasheetVersion: 1/11/2011; ComponentLink1URL: http://www.st.com
Y1 = CMP-2000-05733-3: Crystal 25MHz ±20ppm (Tol) ±30ppm (Stability) 18pF FUND 60Ω 4-Pin SMD T/R; Series Resistance: 60R; Length: 3.2mm; Depth: 2.5mm; Packaging: Tape and Reel; Min Operating Temperature: -40°C; Operating Frequency: 25 MHz; Lead Free: Lead Free; Number of Pins: 4; Frequency Tolerance: 20ppm; Radiation Hardening: No; Max Operating Temperature: 85°C; Termination: SMD/SMT; Frequency Stability: 30ppm; Frequency: 25MHz; Series: ABM8G; Mount: Surface Mount; Package Quantity: 1000; Height: 0.039inch; Width: 0.098inch; Case/Package: CSMD; ESR (Equivalent Series Resistance): 60R; Load Capacitance: 18pF; Tolerance: 20ppm

## Sheet MCP2518_PINOUT.SchDoc
size A4; SheetNumber: 4; SheetTotal: 7
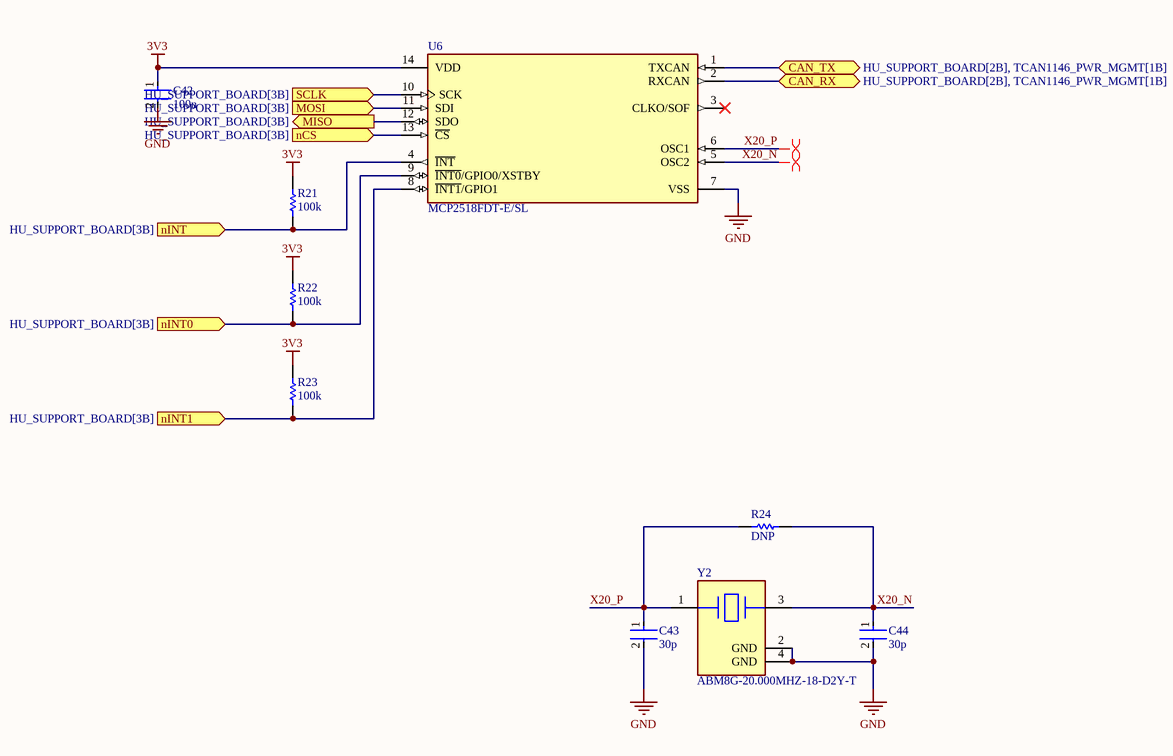
[diagram p8: MCP2518_PINOUT.SchDoc]

### Parts
C42  100n  [FP-0402-L_1_0_0_05-W_0_5-IPC_A]
C43  30p  [FP-0402-L_1_0_0_05-W_0_5-IPC_A]
C44  30p  [FP-0402-L_1_0_0_05-W_0_5-IPC_A]
R21  100k  [R0603B]
R22  100k  [R0603B]
R23  100k  [R0603B]
R24  DNP  [R0603B]
U6  MCP2518FDT-E/SL  [FP-C04-065-SL-IPC_C]
Y2  ABM8G-20.000MHZ-18-D2Y-T  [FP-ABM8G-MFG]

### Ports
CAN_RX (bidir, see HU_SUPPORT_BOARD[2B], TCAN1146_PWR_MGMT[1B]), CAN_TX (bidir, see HU_SUPPORT_BOARD[2B], TCAN1146_PWR_MGMT[1B]), MISO (out, see HU_SUPPORT_BOARD[3B]), MOSI (in, see HU_SUPPORT_BOARD[3B]), nCS (in, see HU_SUPPORT_BOARD[3B]), nINT0 (in, see HU_SUPPORT_BOARD[3B]), nINT1 (in, see HU_SUPPORT_BOARD[3B]), nINT (in, see HU_SUPPORT_BOARD[3B]), SCLK (in, see HU_SUPPORT_BOARD[3B])

### Nets
3V3: C42.1 R21.1 R22.1 R23.1 U6.14(VDD)
GND: C42.2 C43.2 C44.2 U6.7(VSS) Y2.2(GND) Y2.4(GND)
CAN_MISO: U6.12(SDO) ; port MISO
CAN_MOSI: U6.11(SDI) ; port MOSI
CAN_RX: U6.2(RXCAN) ; port CAN_RX
CAN_SCLK: U6.10(SCK) ; port SCLK
CAN_TX: U6.1(TXCAN) ; port CAN_TX
MCP2518_nCS: U6.13(~{CS}) ; port nCS
MCP2518_nINT: R21.2 U6.4(~{INT}) ; port nINT
MCP2518_nINT0: R22.2 U6.9(~{INT0}/GPIO0/XSTBY) ; port nINT0
MCP2518_nINT1: R23.2 U6.8(~{INT1}/GPIO1) ; port nINT1
X20_N: C44.1 R24.2 U6.5(OSC2) Y2.3
X20_P: C43.1 R24.1 U6.6(OSC1) Y2.1

Not connected (* = marked no-connect by the designer): U6 3(CLKO/SOF)*

### Layout directives
differential pair: X20_N, X20_P

### Library data of the parts
C42-C44 = CMP-001-00058-1: as C45 on sheet TCAN1146_PWR_MGMT; Min Operating Temperature: -55°C; Mounting Technology: Surface Mount; Pins: 2; Case/Package: 0402; RoHS Compliant: Yes; Max Operating Temperature: 85°C
R21-R24 = CMP-009-00002-14: Resistor; Value: 330
U6 = CMP-06298-000019-1: IC CAN CONTROLLER SPI 14SOIC; RoHS Compliant: Yes
Y2 = CMP-27762-015817-1: Crystal 20MHz ±20ppm (Tol) ±30ppm (Stability) 18pF FUND 80Ω 4-Pin SMD T/R; ESR (Equivalent Series Resistance): 80R; Termination: SMD/SMT; Length: 3.2mm; Packaging: Tape and Reel; Width: 2.5mm; Load Capacitance: 18pF; Height: 1mm; Min Operating Temperature: -40°C; Tolerance: 20ppm; Number of Pins: 4; Depth: 2.5mm; Series: ABM8G; Frequency: 20MHz; Package Quantity: 1000; Frequency Tolerance: 20ppm; Mount: Surface Mount; Max Operating Temperature: 85°C; Case/Package: CSMD; Frequency Stability: 30ppm